# EAGLE schematic plc_sam4e (EAGLE 9.6.2)

## Sheet 1 of 2
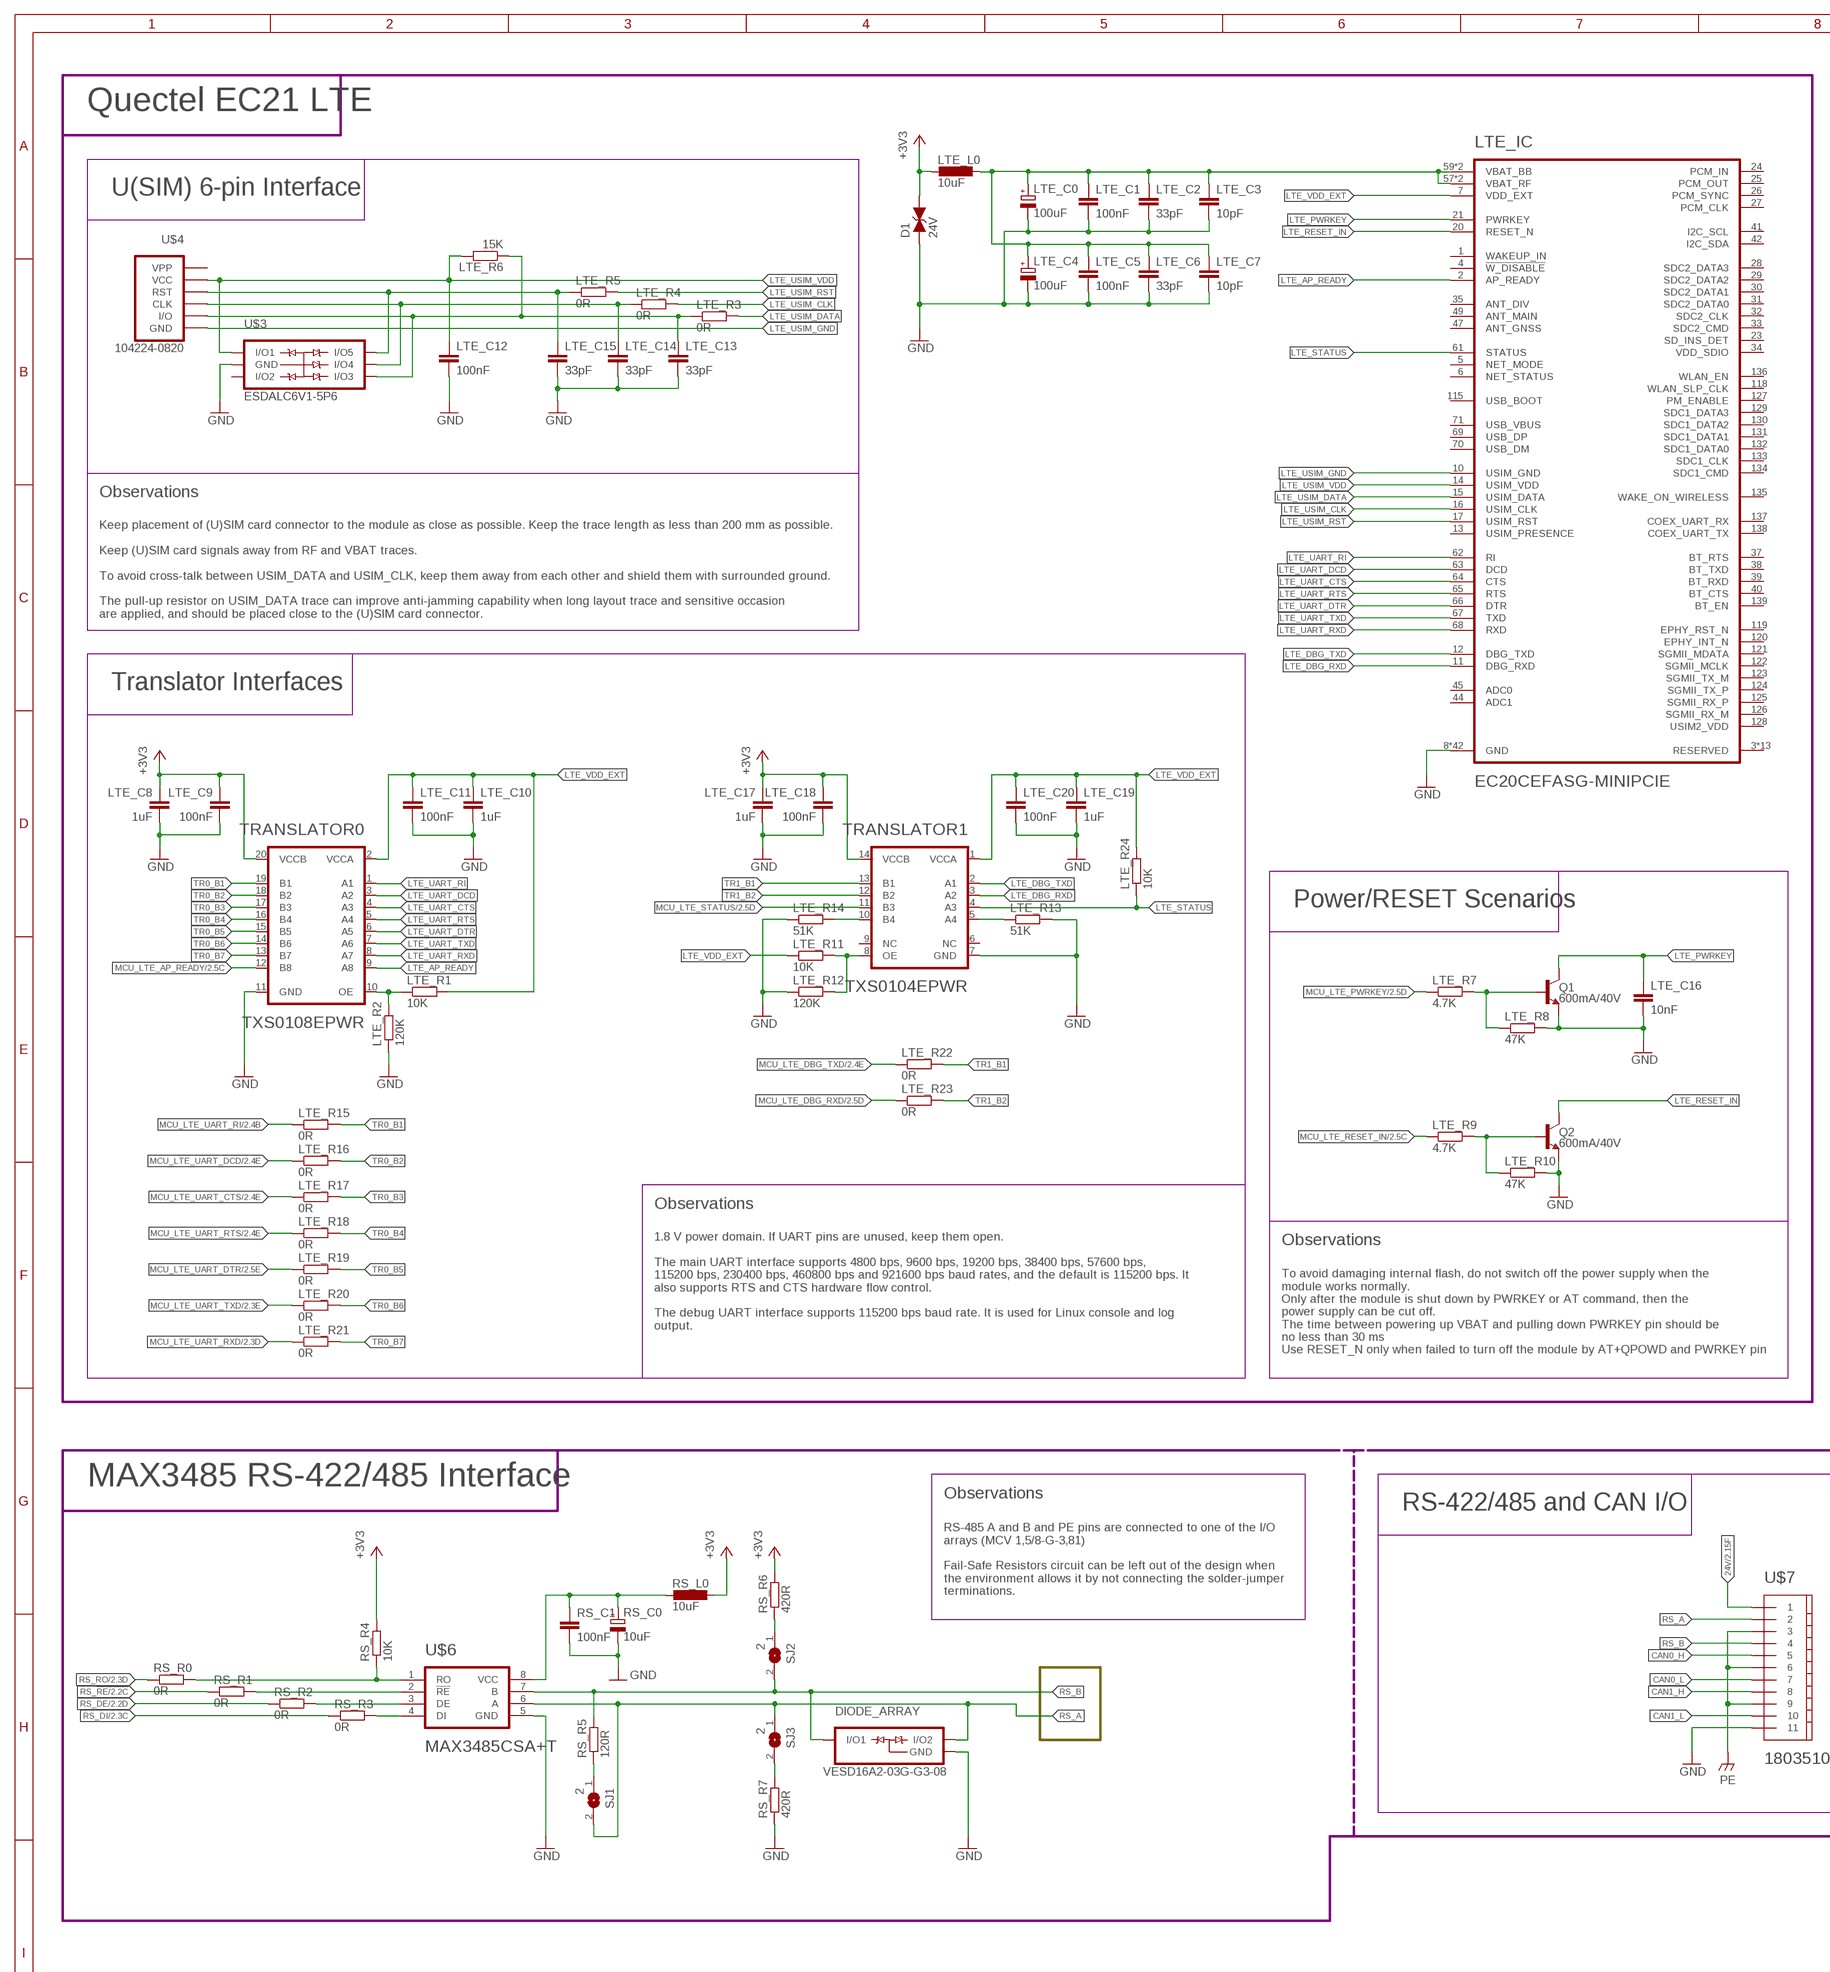
[diagram p0: schematic, sheet 1, part 1 of 2]
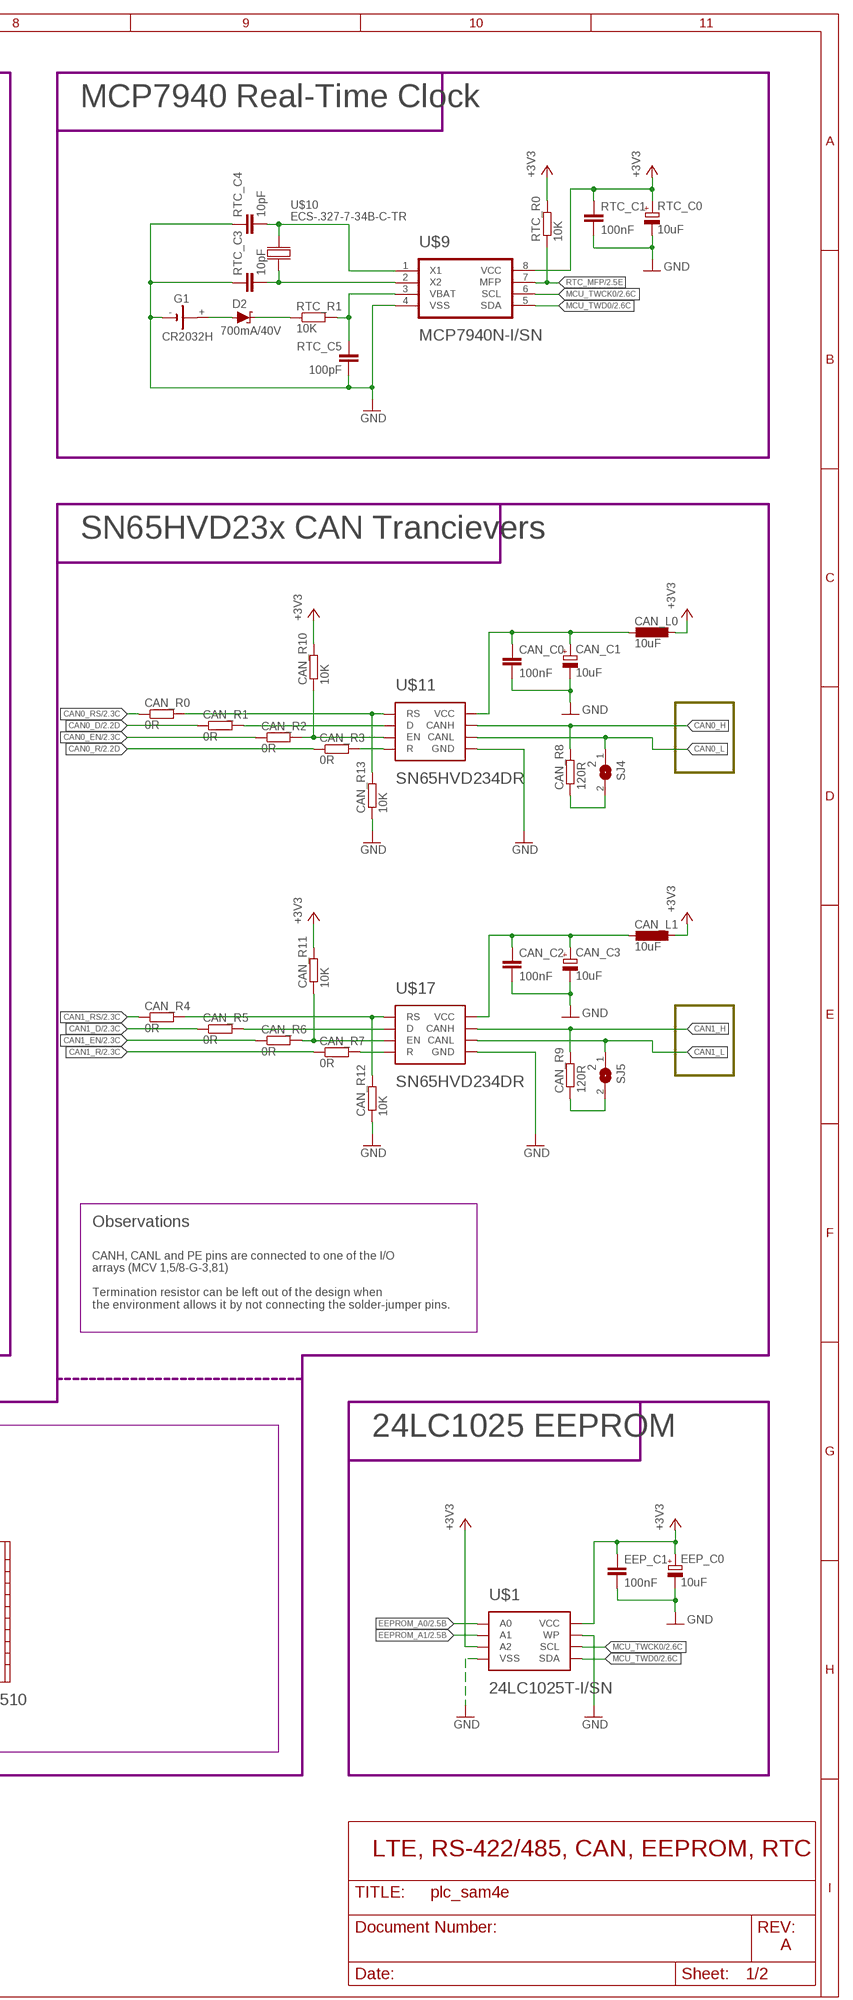
[diagram p1: schematic, sheet 1, part 2 of 2]

### Parts
CAN_C0  100nF  C-EUC0402  [C0402]
CAN_C1  10uF  CPOL-EUSMCB  [SMC_B]
CAN_C2  100nF  C-EUC0402  [C0402]
CAN_C3  10uF  CPOL-EUSMCB  [SMC_B]
CAN_L0  10uF  L-EUL1812  [L1812]
CAN_L1  10uF  L-EUL1812  [L1812]
CAN_R0  0R  R-EU_R0402  [R0402]
CAN_R1  0R  R-EU_R0402  [R0402]
CAN_R2  0R  R-EU_R0402  [R0402]
CAN_R3  0R  R-EU_R0402  [R0402]
CAN_R4  0R  R-EU_R0402  [R0402]
CAN_R5  0R  R-EU_R0402  [R0402]
CAN_R6  0R  R-EU_R0402  [R0402]
CAN_R7  0R  R-EU_R0402  [R0402]
CAN_R8  120R  R-EU_R0402  [R0402]
CAN_R9  120R  R-EU_R0402  [R0402]
CAN_R10  10K  R-EU_R0402  [R0402]
CAN_R11  10K  R-EU_R0402  [R0402]
CAN_R12  10K  R-EU_R0402  [R0402]
CAN_R13  10K  R-EU_R0402  [R0402]
D1  24V  DIODE_TVS  [0603]
D2  700mA/40V  DIODE-SCHOTTKY-ZLLS500  [SOT23-3]
DIODE_ARRAY  VESD16A2-03G-G3-08  [SOT-323-3]
EEP_C0  10uF  CPOL-EUSMCB  [SMC_B]
EEP_C1  100nF  C-EUC0402  [C0402]
G1  CR2032H  [CR2032H]
LTE_C0  100uF  CPOL-EUSMCB  [SMC_B]
LTE_C1  100nF  C-EUC0402  [C0402]
LTE_C2  33pF  C-EUC0402  [C0402]
LTE_C3  10pF  C-EUC0402  [C0402]
LTE_C4  100uF  CPOL-EUSMCB  [SMC_B]
LTE_C5  100nF  C-EUC0402  [C0402]
LTE_C6  33pF  C-EUC0402  [C0402]
LTE_C7  10pF  C-EUC0402  [C0402]
LTE_C8  1uF  C-EUC0402  [C0402]
LTE_C9  100nF  C-EUC0402  [C0402]
LTE_C10  1uF  C-EUC0402  [C0402]
LTE_C11  100nF  C-EUC0402  [C0402]
LTE_C12  100nF  C-EUC0402  [C0402]
LTE_C13  33pF  C-EUC0402  [C0402]
LTE_C14  33pF  C-EUC0402  [C0402]
LTE_C15  33pF  C-EUC0402  [C0402]
LTE_C16  10nF  C-EUC0402  [C0402]
LTE_C17  1uF  C-EUC0402  [C0402]
LTE_C18  100nF  C-EUC0402  [C0402]
LTE_C19  1uF  C-EUC0402  [C0402]
LTE_C20  100nF  C-EUC0402  [C0402]
LTE_IC  EC20CEFASG-MINIPCIE  [EC21]
LTE_L0  10uF  L-EUL1812  [L1812]
LTE_R1  10K  R-EU_R0402  [R0402]
LTE_R2  120K  R-EU_R0402  [R0402]
LTE_R3  0R  R-EU_R0402  [R0402]
LTE_R4  0R  R-EU_R0402  [R0402]
LTE_R5  0R  R-EU_R0402  [R0402]
LTE_R6  15K  R-EU_R0402  [R0402]
LTE_R7  4.7K  R-EU_R0402  [R0402]
LTE_R8  47K  R-EU_R0402  [R0402]
LTE_R9  4.7K  R-EU_R0402  [R0402]
LTE_R10  47K  R-EU_R0402  [R0402]
LTE_R11  10K  R-EU_R0402  [R0402]
LTE_R12  120K  R-EU_R0402  [R0402]
LTE_R13  51K  R-EU_R0402  [R0402]
LTE_R14  51K  R-EU_R0402  [R0402]
LTE_R15  0R  R-EU_R0402  [R0402]
LTE_R16  0R  R-EU_R0402  [R0402]
LTE_R17  0R  R-EU_R0402  [R0402]
LTE_R18  0R  R-EU_R0402  [R0402]
LTE_R19  0R  R-EU_R0402  [R0402]
LTE_R20  0R  R-EU_R0402  [R0402]
LTE_R21  0R  R-EU_R0402  [R0402]
LTE_R22  0R  R-EU_R0402  [R0402]
LTE_R23  0R  R-EU_R0402  [R0402]
LTE_R24  10K  R-EU_R0402  [R0402]
Q1  600mA/40V  TRANS_NPN-MMBT2222AL  [SOT23-3]
Q2  600mA/40V  TRANS_NPN-MMBT2222AL  [SOT23-3]
RS_C0  10uF  CPOL-EUSMCB  [SMC_B]
RS_C1  100nF  C-EUC0402  [C0402]
RS_L0  10uF  L-EUL1812  [L1812]
RS_R0  0R  R-EU_R0402  [R0402]
RS_R1  0R  R-EU_R0402  [R0402]
RS_R2  0R  R-EU_R0402  [R0402]
RS_R3  0R  R-EU_R0402  [R0402]
RS_R4  10K  R-EU_R0402  [R0402]
RS_R5  120R  R-EU_R0402  [R0402]
RS_R6  420R  R-EU_R0402  [R0402]
RS_R7  420R  R-EU_R0402  [R0402]
RTC_C0  10uF  CPOL-EUSMCB  [SMC_B]
RTC_C1  100nF  C-EUC0402  [C0402]
RTC_C3  10pF  C-EUC0402  [C0402]
RTC_C4  10pF  C-EUC0402  [C0402]
RTC_C5  100pF  C-EUC0402  [C0402]
RTC_R0  10K  R-EU_R0402  [R0402]
RTC_R1  10K  R-EU_R0402  [R0402]
SJ1  2  SJ  [SJ]
SJ2  2  SJ  [SJ]
SJ3  2  SJ  [SJ]
SJ4  2  SJ  [SJ]
SJ5  2  SJ  [SJ]
TRANSLATOR0  TXS0108EPWR  [TSSOP-20]
TRANSLATOR1  TXS0104EPWR  [TSSOP-14]
U$1  24LC1025T-I/SN  [SOIC-8]
U$3  ESDALC6V1-5P6  [SOT-666]
U$4  104224-0820  [104224-0820]
U$6  MAX3485CSA+T  [SOIC-8]
U$7  1803510  [1803510]
U$9  MCP7940N-I/SN  [SOIC-8]
U$10  ECS-.327-7-34B-C-TR  [3.2X1.5MM]
U$11  SN65HVD234DR  [SOIC-8]
U$17  SN65HVD234DR  [SOIC-8]

### Nets
24V: U$7.1 ; also sheet 2
+3V3: CAN_L0.1 CAN_L1.1 CAN_R10.2 CAN_R11.2 D1.2(C) EEP_C0.+ EEP_C1.1 LTE_C8.1 LTE_C9.1 LTE_C17.1 LTE_C18.1 LTE_L0.2 RS_L0.1 RS_R4.2 RS_R6.2 RTC_C0.+ RTC_C1.1 RTC_R0.2 TRANSLATOR0.20(VCCB) TRANSLATOR1.14(VCCB) U$1.3(A2) U$1.8(VCC) U$9.8(VCC) ; also sheet 2
CAN0_D: CAN_R1.1 ; also sheet 2
CAN0_EN: CAN_R2.1 ; also sheet 2
CAN0_H: CAN_R8.2 U$7.5 U$11.7(CANH)
CAN0_L: SJ4.1 U$7.7 U$11.6(CANL)
CAN0_R: CAN_R3.1 ; also sheet 2
CAN0_RS: CAN_R0.1 ; also sheet 2
CAN1_D: CAN_R5.1 ; also sheet 2
CAN1_EN: CAN_R6.1 ; also sheet 2
CAN1_H: CAN_R9.2 U$7.8 U$17.7(CANH)
CAN1_L: SJ5.1 U$7.10 U$17.6(CANL)
CAN1_R: CAN_R7.1 ; also sheet 2
CAN1_RS: CAN_R4.1 ; also sheet 2
EEPROM_A0: U$1.1(A0) ; also sheet 2
EEPROM_A1: U$1.2(A1) ; also sheet 2
GND: CAN_C0.2 CAN_C1.- CAN_C2.2 CAN_C3.- CAN_R12.1 CAN_R13.1 D1.1(A) DIODE_ARRAY.3(GND) EEP_C0.- EEP_C1.2 G1.- LTE_C0.- LTE_C1.2 LTE_C2.2 LTE_C3.2 LTE_C4.- LTE_C5.2 LTE_C6.2 LTE_C7.2 LTE_C8.2 LTE_C9.2 LTE_C10.2 LTE_C11.2 LTE_C12.2 LTE_C13.2 LTE_C14.2 LTE_C15.2 LTE_C16.2 LTE_C17.2 LTE_C18.2 LTE_C19.2 LTE_C20.2 LTE_IC.8(GND) LTE_IC.9(GND) LTE_IC.19(GND) LTE_IC.22(GND) LTE_IC.36(GND) LTE_IC.46(GND) LTE_IC.48(GND) LTE_IC.50(GND) LTE_IC.51(GND) LTE_IC.52(GND) LTE_IC.53(GND) LTE_IC.54(GND) LTE_IC.56(GND) LTE_IC.72(GND) LTE_IC.85(GND) LTE_IC.86(GND) LTE_IC.87(GND) LTE_IC.88(GND) LTE_IC.89(GND) LTE_IC.90(GND) LTE_IC.91(GND) LTE_IC.92(GND) LTE_IC.93(GND) LTE_IC.94(GND) LTE_IC.95(GND) LTE_IC.96(GND) LTE_IC.97(GND) LTE_IC.98(GND) LTE_IC.99(GND) LTE_IC.100(GND) LTE_IC.101(GND) LTE_IC.102(GND) LTE_IC.103(GND) LTE_IC.104(GND) LTE_IC.105(GND) LTE_IC.106(GND) LTE_IC.107(GND) LTE_IC.108(GND) LTE_IC.109(GND) LTE_IC.110(GND) LTE_IC.111(GND) LTE_IC.112(GND) LTE_R2.1 LTE_R8.2 LTE_R10.2 LTE_R12.1 LTE_R13.2 LTE_R14.1 Q1.2(E) Q2.2(E) RS_C0.- RS_C1.2 RS_R7.1 RTC_C0.- RTC_C1.2 RTC_C3.1 RTC_C4.1 RTC_C5.2 TRANSLATOR0.11(GND) TRANSLATOR1.7(GND) U$1.4(VSS) U$1.7(WP) U$3.2(GND) U$6.5(GND) U$7.11 U$9.4(VSS) U$11.2(GND) U$17.2(GND) ; also sheet 2
LTE_AP_READY: LTE_IC.2(AP_READY) TRANSLATOR0.9(A8)
LTE_DBG_RXD: LTE_IC.11(DBG_RXD) TRANSLATOR1.3(A2)
LTE_DBG_TXD: LTE_IC.12(DBG_TXD) TRANSLATOR1.2(A1)
LTE_PWRKEY: LTE_C16.1 LTE_IC.21(PWRKEY) Q1.3(C)
LTE_RESET_IN: LTE_IC.20(RESET_N) Q2.3(C)
LTE_STATUS: LTE_IC.61(STATUS) LTE_R24.1 TRANSLATOR1.4(A3)
LTE_UART_CTS: LTE_IC.64(CTS) TRANSLATOR0.4(A3)
LTE_UART_DCD: LTE_IC.63(DCD) TRANSLATOR0.3(A2)
LTE_UART_DTR: LTE_IC.66(DTR) TRANSLATOR0.6(A5)
LTE_UART_RI: LTE_IC.62(RI) TRANSLATOR0.1(A1)
LTE_UART_RTS: LTE_IC.65(RTS) TRANSLATOR0.5(A4)
LTE_UART_RXD: LTE_IC.68(RXD) TRANSLATOR0.8(A7)
LTE_UART_TXD: LTE_IC.67(TXD) TRANSLATOR0.7(A6)
LTE_USIM_CLK: LTE_IC.16(USIM_CLK) LTE_R4.2
LTE_USIM_DATA: LTE_IC.15(USIM_DATA) LTE_R3.2
LTE_USIM_GND: LTE_IC.10(USIM_GND) U$4.G1(GND) U$4.G2(GND) U$4.G3(GND) U$4.G4(GND) U$4.S4(GND)
LTE_USIM_RST: LTE_IC.17(USIM_RST) LTE_R5.2
LTE_USIM_VDD: LTE_C12.1 LTE_IC.14(USIM_VDD) LTE_R6.2 U$3.1(I/O1) U$4.S1(VCC)
LTE_VBAT: LTE_C0.+ LTE_C1.1 LTE_C2.1 LTE_C3.1 LTE_C4.+ LTE_C5.1 LTE_C6.1 LTE_C7.1 LTE_IC.57(VBAT_RF) LTE_IC.58(VBAT_RF) LTE_IC.59(VBAT_BB) LTE_IC.60(VBAT_BB) LTE_L0.1
LTE_VDD_EXT: LTE_C10.1 LTE_C11.1 LTE_C19.1 LTE_C20.1 LTE_IC.7(VDD_EXT) LTE_R1.2 LTE_R11.1 LTE_R24.2 TRANSLATOR0.2(VCCA) TRANSLATOR1.1(VCCA)
MCU_LTE_AP_READY: TRANSLATOR0.12(B8) ; also sheet 2
MCU_LTE_DBG_RXD: LTE_R23.1 ; also sheet 2
MCU_LTE_DBG_TXD: LTE_R22.1 ; also sheet 2
MCU_LTE_PWRKEY: LTE_R7.1 ; also sheet 2
MCU_LTE_RESET_IN: LTE_R9.1 ; also sheet 2
MCU_LTE_STATUS: TRANSLATOR1.11(B3) ; also sheet 2
MCU_LTE_UART_CTS: LTE_R17.1 ; also sheet 2
MCU_LTE_UART_DCD: LTE_R16.1 ; also sheet 2
MCU_LTE_UART_DTR: LTE_R19.1 ; also sheet 2
MCU_LTE_UART_RI: LTE_R15.1 ; also sheet 2
MCU_LTE_UART_RTS: LTE_R18.1 ; also sheet 2
MCU_LTE_UART_RXD: LTE_R21.1 ; also sheet 2
MCU_LTE_UART_TXD: LTE_R20.1 ; also sheet 2
MCU_TWCK0: U$1.6(SCL) U$9.6(SCL) ; also sheet 2
MCU_TWD0: U$1.5(SDA) U$9.5(SDA) ; also sheet 2
N$1: LTE_R7.2 LTE_R8.1 Q1.1(B)
N$2: RS_R0.2 RS_R4.1 U$6.1(RO)
N$3: RS_R1.2 U$6.2(!RE)
N$4: RS_R2.2 U$6.3(DE)
N$5: LTE_R9.2 LTE_R10.1 Q2.1(B)
N$6: LTE_R14.2 TRANSLATOR1.10(B4)
N$8: RTC_C4.2 U$9.1(X1) U$10.2
N$9: RS_R3.2 U$6.4(DI)
N$10: CAN_R3.2 U$11.4(R)
N$11: RTC_C3.2 U$9.2(X2) U$10.1
N$12: CAN_R2.2 CAN_R10.1 U$11.5(EN)
N$13: D2.3(C) RTC_R1.1
N$16: D2.1(A) G1.+
N$17: LTE_R13.1 TRANSLATOR1.5(A4)
N$18: RTC_C5.1 RTC_R1.2 U$9.3(VBAT)
N$19: CAN_R1.2 U$11.1(D)
N$21: RS_R5.1 SJ1.1
N$23: CAN_R0.2 CAN_R13.2 U$11.8(RS)
N$34: RS_R6.1 SJ2.1
N$35: RS_R7.2 SJ3.2
N$38: LTE_R1.1 LTE_R2.2 TRANSLATOR0.10(OE)
N$40: CAN_R4.2 CAN_R12.2 U$17.8(RS)
N$41: CAN_R5.2 U$17.1(D)
N$42: CAN_R6.2 CAN_R11.1 U$17.5(EN)
N$43: CAN_R7.2 U$17.4(R)
N$46: RS_C0.+ RS_C1.1 RS_L0.2 U$6.8(VCC)
N$49: CAN_R8.1 SJ4.2
N$50: CAN_R9.1 SJ5.2
N$51: LTE_C15.1 LTE_R5.1 U$3.6(I/O5) U$4.S2(RST)
N$52: LTE_C14.1 LTE_R4.1 U$3.5(I/O4) U$4.S3(CLK)
N$53: LTE_C13.1 LTE_R3.1 LTE_R6.1 U$3.4(I/O3) U$4.S6(I/O)
N$54: CAN_C0.1 CAN_C1.+ CAN_L0.2 U$11.3(VCC)
N$55: CAN_C2.1 CAN_C3.+ CAN_L1.2 U$17.3(VCC)
N$84: LTE_R11.2 LTE_R12.2 TRANSLATOR1.8(OE)
P$1: U$7.3 U$7.6 U$7.9 ; supply symbol labelled PE ; also sheet 2
RS_!RE: RS_R1.1 ; also sheet 2
RS_A: DIODE_ARRAY.2(I/O2) SJ1.2 SJ3.1 U$6.6(A) U$7.2
RS_B: DIODE_ARRAY.1(I/O1) RS_R5.2 SJ2.2 U$6.7(B) U$7.4
RS_DE: RS_R2.1 ; also sheet 2
RS_DI: RS_R3.1 ; also sheet 2
RS_RO: RS_R0.1 ; also sheet 2
RTC_MFP: RTC_R0.1 U$9.7(MFP) ; also sheet 2
TR0_B1: LTE_R15.2 TRANSLATOR0.19(B1)
TR0_B2: LTE_R16.2 TRANSLATOR0.18(B2)
TR0_B3: LTE_R17.2 TRANSLATOR0.17(B3)
TR0_B4: LTE_R18.2 TRANSLATOR0.16(B4)
TR0_B5: LTE_R19.2 TRANSLATOR0.15(B5)
TR0_B6: LTE_R20.2 TRANSLATOR0.14(B6)
TR0_B7: LTE_R21.2 TRANSLATOR0.13(B7)
TR1_B1: LTE_R22.2 TRANSLATOR1.13(B1)
TR1_B2: LTE_R23.2 TRANSLATOR1.12(B2)
Unconnected: G1.+@1(+) LTE_IC.1(WAKEUP_IN) LTE_IC.3(RESERVED) LTE_IC.4(!W_DISABLE) LTE_IC.5(NET_MODE) LTE_IC.6(NET_STATUS) LTE_IC.13(USIM_PRESENCE) LTE_IC.18(RESERVED) LTE_IC.23(SD_INS_DET) LTE_IC.24(PCM_IN) LTE_IC.25(PCM_OUT) LTE_IC.26(PCM_SYNC) LTE_IC.27(PCM_CLK) LTE_IC.28(SDC2_DATA3) LTE_IC.29(SDC2_DATA2) LTE_IC.30(SDC2_DATA1) LTE_IC.31(SDC2_DATA0) LTE_IC.32(SDC2_CLK) LTE_IC.33(SDC2_CMD) LTE_IC.34(VDD_SDIO) LTE_IC.35(ANT_DIV) LTE_IC.37(BT_RTS) LTE_IC.38(BT_TXD) LTE_IC.39(BT_RXD) LTE_IC.40(BT_CTS) LTE_IC.41(I2C_SCL) LTE_IC.42(I2C_SDA) LTE_IC.43(RESERVED) LTE_IC.44(ADC1) LTE_IC.45(ADC0) LTE_IC.47(ANT_GNSS) LTE_IC.49(ANT_MAIN) LTE_IC.55(RESERVED) LTE_IC.69(USB_DP) LTE_IC.70(USB_DM) LTE_IC.71(USB_VBUS) LTE_IC.113(RESERVED) LTE_IC.114(RESERVED) LTE_IC.115(USB_BOOT) LTE_IC.116(RESERVED) LTE_IC.117(RESERVED) LTE_IC.118(WLAN_SLP_CLK) LTE_IC.119(EPHY_RST_N) LTE_IC.120(EPHY_INT_N) LTE_IC.121(SGMII_MDATA) LTE_IC.122(SGMII_MCLK) LTE_IC.123(SGMII_TX_M) LTE_IC.124(SGMII_TX_P) LTE_IC.125(SGMII_RX_P) LTE_IC.126(SGMII_RX_M) LTE_IC.127(PM_ENABLE) LTE_IC.128(USIM2_VDD) LTE_IC.129(SDC1_DATA3) LTE_IC.130(SDC1_DATA2) LTE_IC.131(SDC1_DATA1) LTE_IC.132(SDC1_DATA0) LTE_IC.133(SDC1_CLK) LTE_IC.134(SDC1_CMD) LTE_IC.135(WAKE_ON_WIRELESS) LTE_IC.136(WLAN_EN) LTE_IC.137(COEX_UART_RX) LTE_IC.138(COEX_UART_TX) LTE_IC.139(BT_EN) LTE_IC.140(RESERVED) LTE_IC.141(RESERVED) LTE_IC.142(RESERVED) LTE_IC.143(RESERVED) LTE_IC.144(RESERVED) TRANSLATOR1.6(NC) TRANSLATOR1.9(NC) U$3.3(I/O2) U$4.S5(VPP)

### Notes on the sheet
- Quectel EC21 LTE | MCP7940 Real-Time Clock
- U(SIM) 6-pin Interface
- Observations
- SN65HVD23x CAN Trancievers
- Keep placement of (U)SIM card connector to the module as close as possible. Keep the trace length as less than 200 mm as possible.
  
  Keep (U)SIM card signals away from RF and VBAT traces.
  
  To avoid cross-talk between USIM_DATA and USIM_CLK, keep them away from each other and shield them with surrounded ground.
  
  The pull-up resistor on USIM_DATA trace can improve anti-jamming capability when long layout trace and sensitive occasion
  are applied, and should be placed close to the (U)SIM card connector.
- Translator Interfaces
- Power/RESET Scenarios
- Observations
- Observations
- Observations
- 1.8 V power domain. If UART pins are unused, keep them open.
  
  The main UART interface supports 4800 bps, 9600 bps, 19200 bps, 38400 bps, 57600 bps,
  115200 bps, 230400 bps, 460800 bps and 921600 bps baud rates, and the default is 115200 bps. It
  also supports RTS and CTS hardware flow control.
  
  The debug UART interface supports 115200 bps baud rate. It is used for Linux console and log
  output.
- To avoid damaging internal flash, do not switch off the power supply when the
  module works normally.
  Only after the module is shut down by PWRKEY or AT command, then the
  power supply can be cut off.
  The time between powering up VBAT and pulling down PWRKEY pin should be
  no less than 30 ms
  Use RESET_N only when failed to turn off the module by AT+QPOWD and PWRKEY pin
- CANH, CANL and PE pins are connected to one of the I/O
  arrays (MCV 1,5/8-G-3,81)
  
  Termination resistor can be left out of the design when
  the environment allows it by not connecting the solder-jumper pins.
- MAX3485 RS-422/485 Interface | 24LC1025 EEPROM
- Observations
- RS-422/485 and CAN I/O
- RS-485 A and B and PE pins are connected to one of the I/O
  arrays (MCV 1,5/8-G-3,81)
  
  Fail-Safe Resistors circuit can be left out of the design when
  the environment allows it by not connecting the solder-jumper
  terminations.
- LTE, RS-422/485, CAN, EEPROM, RTC
- A

## Sheet 2 of 2
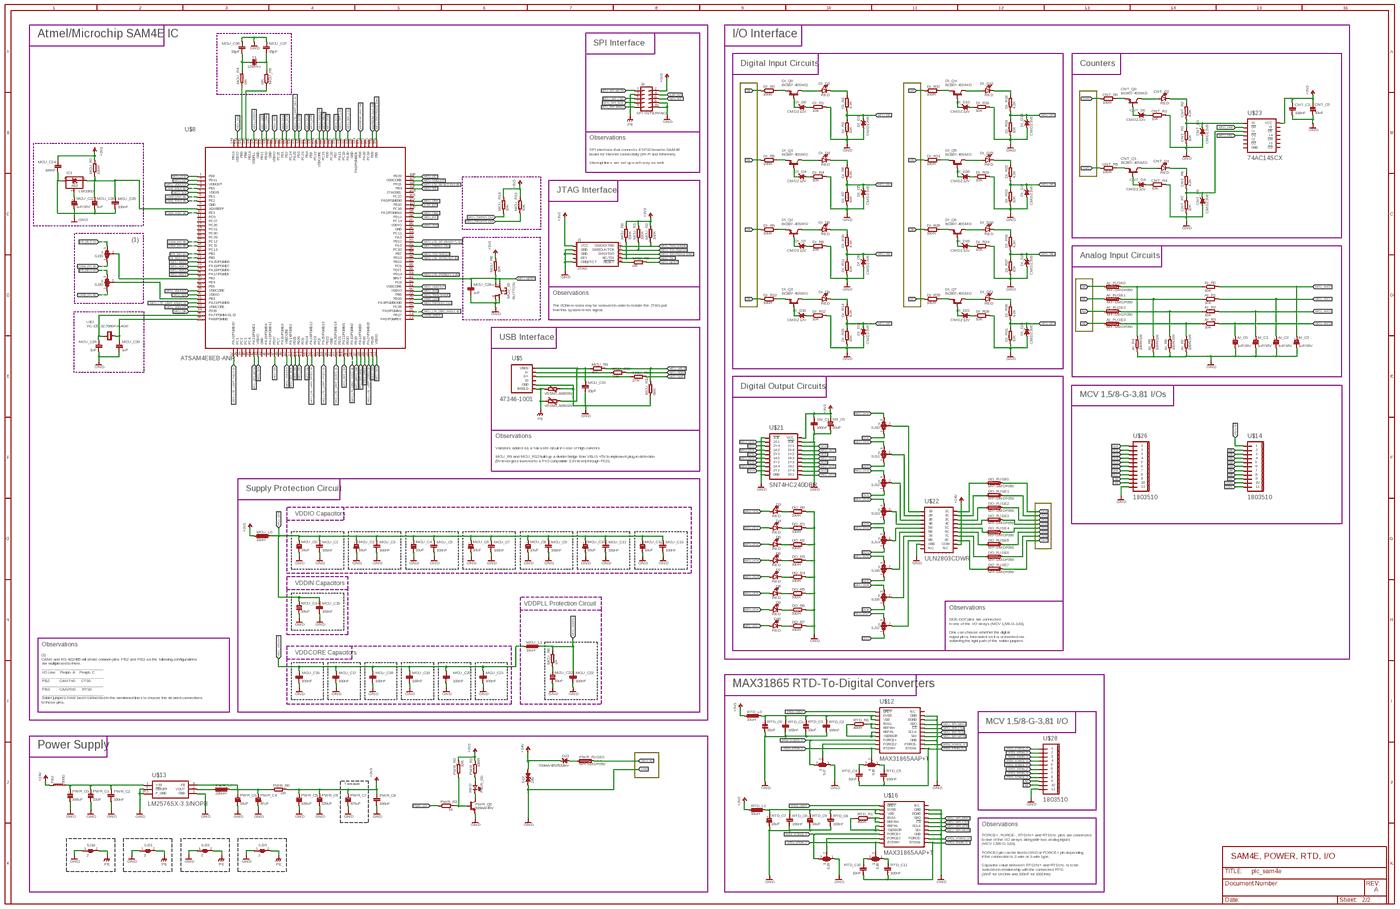
[diagram p2: schematic, sheet 2, overview]
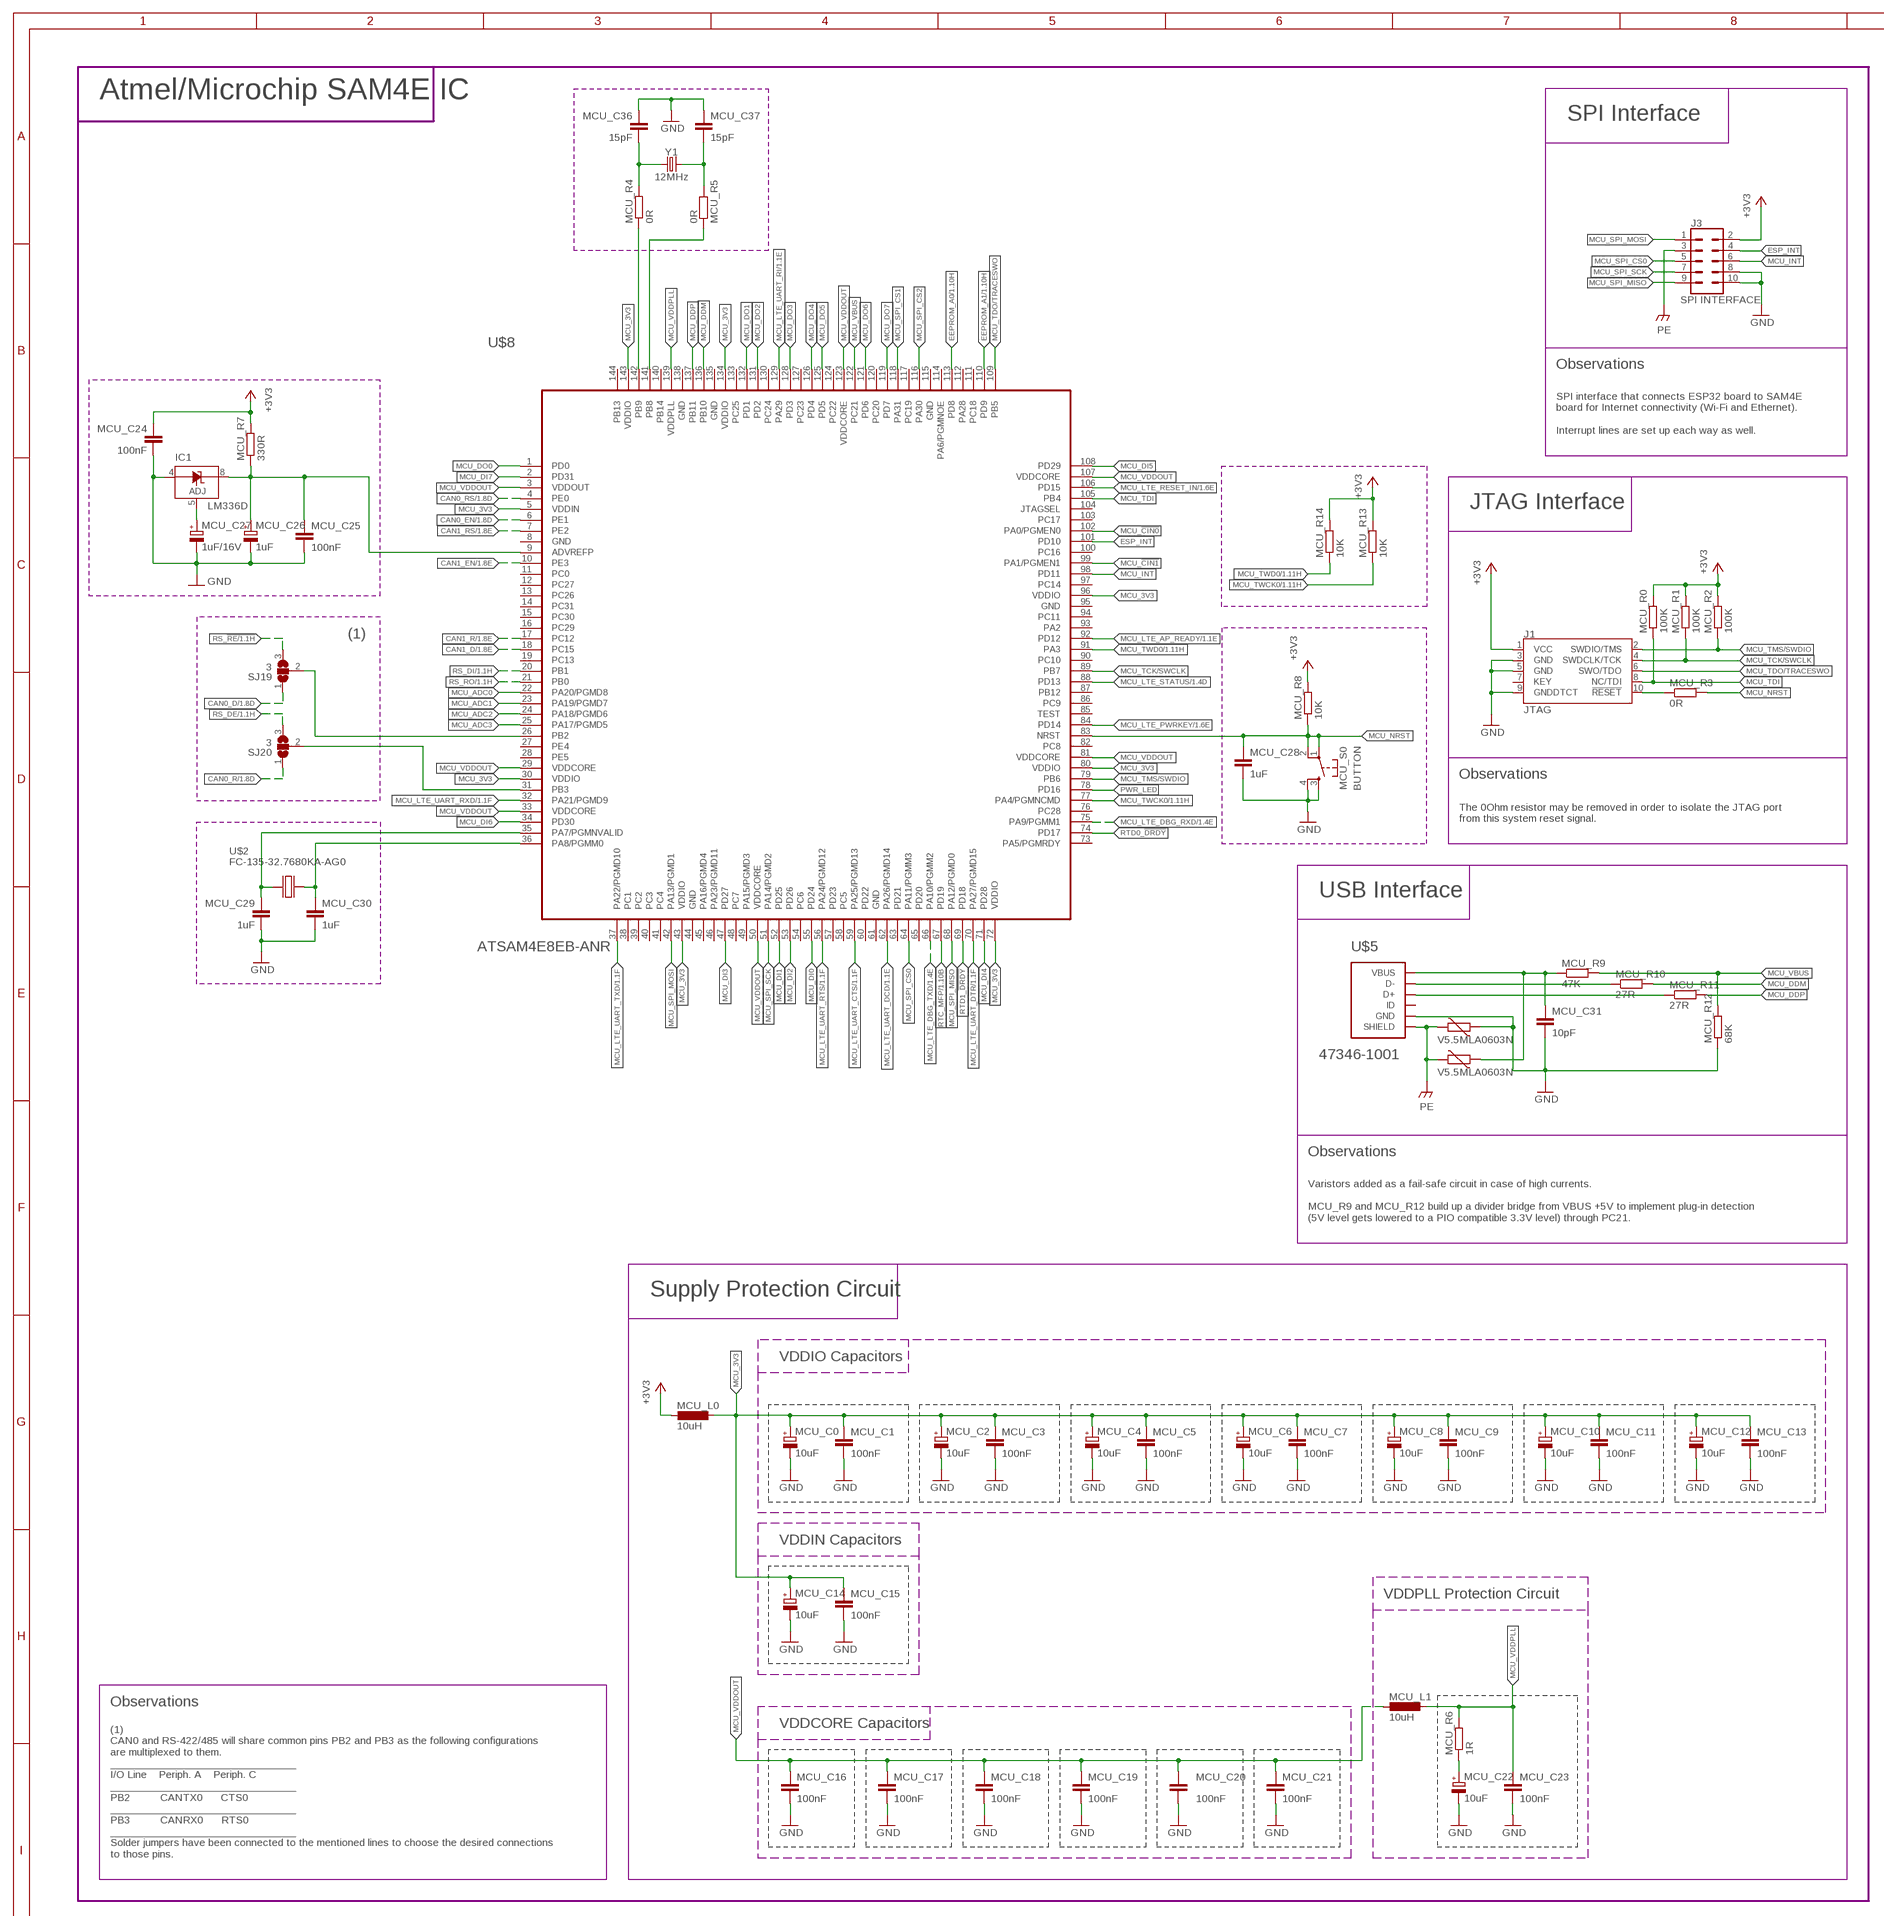
[diagram p3: schematic, sheet 2, part 1 of 4]
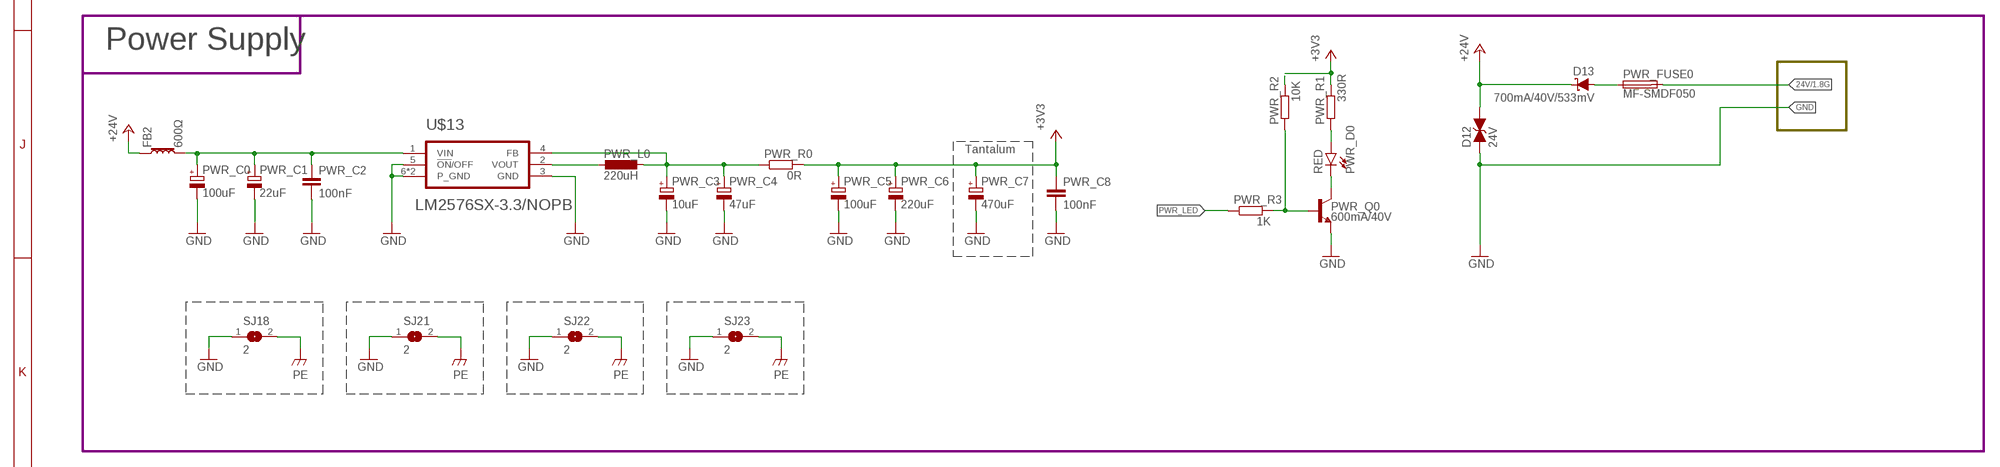
[diagram p4: schematic, sheet 2, part 2 of 4]
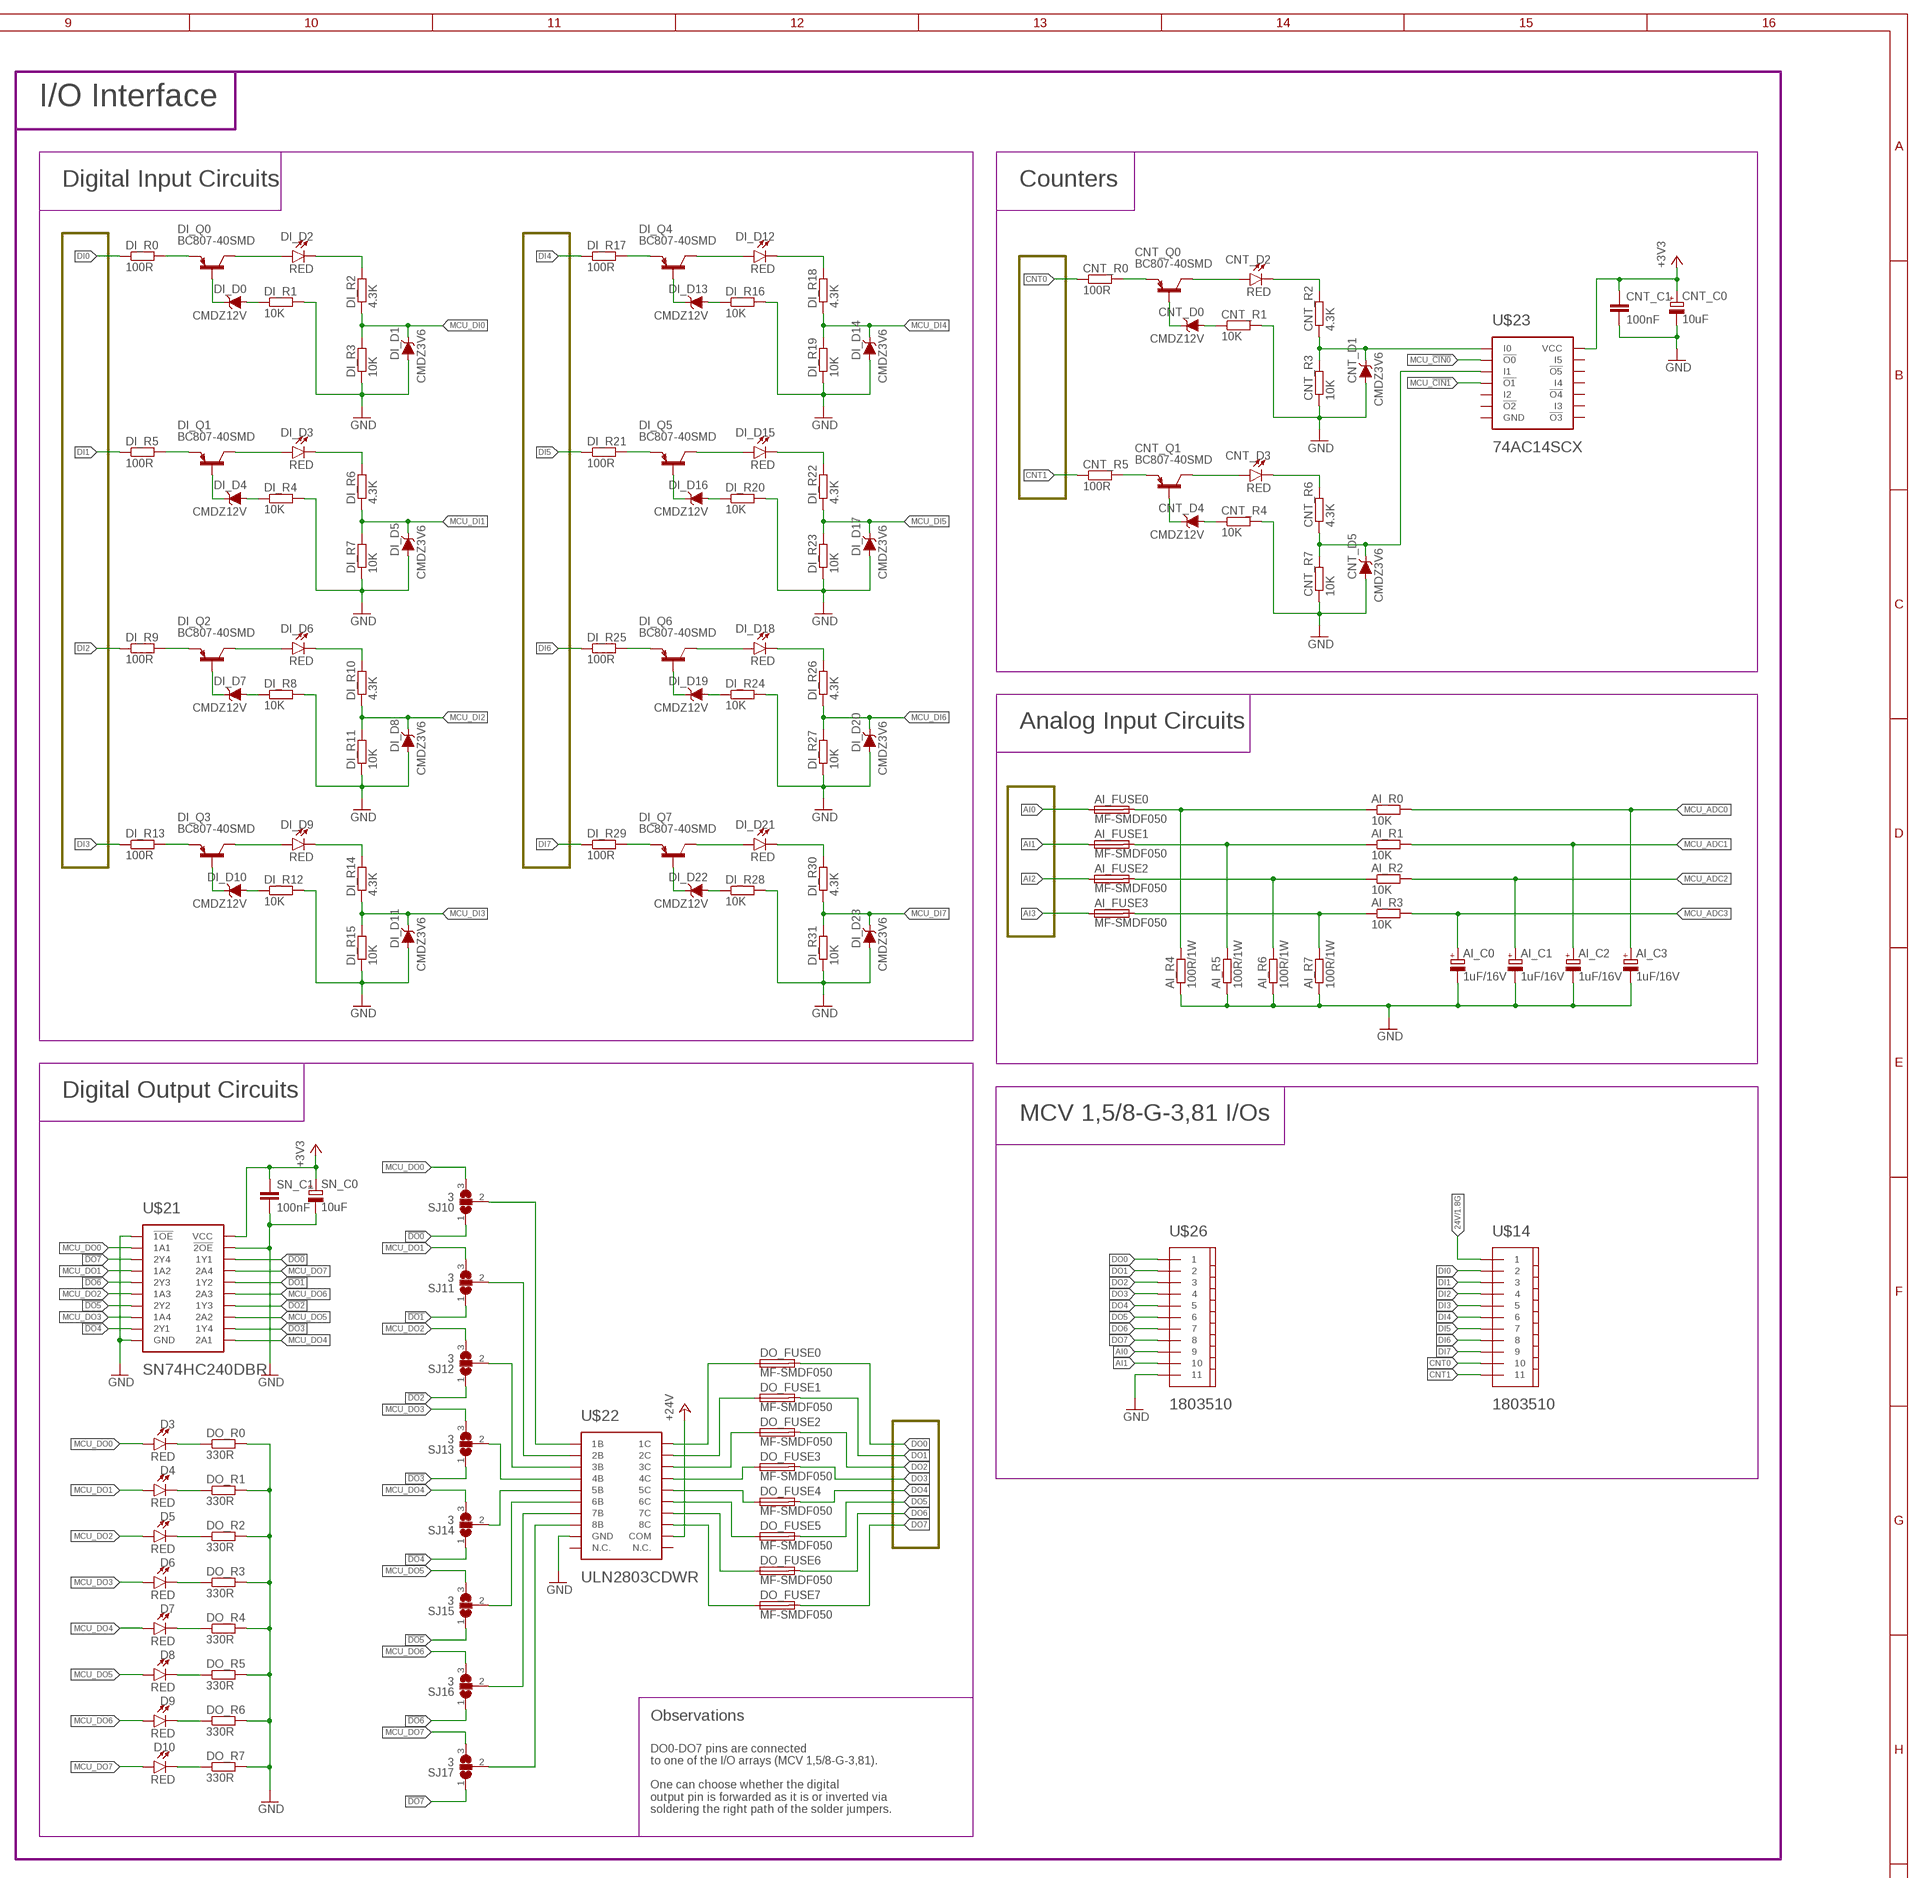
[diagram p5: schematic, sheet 2, part 3 of 4]
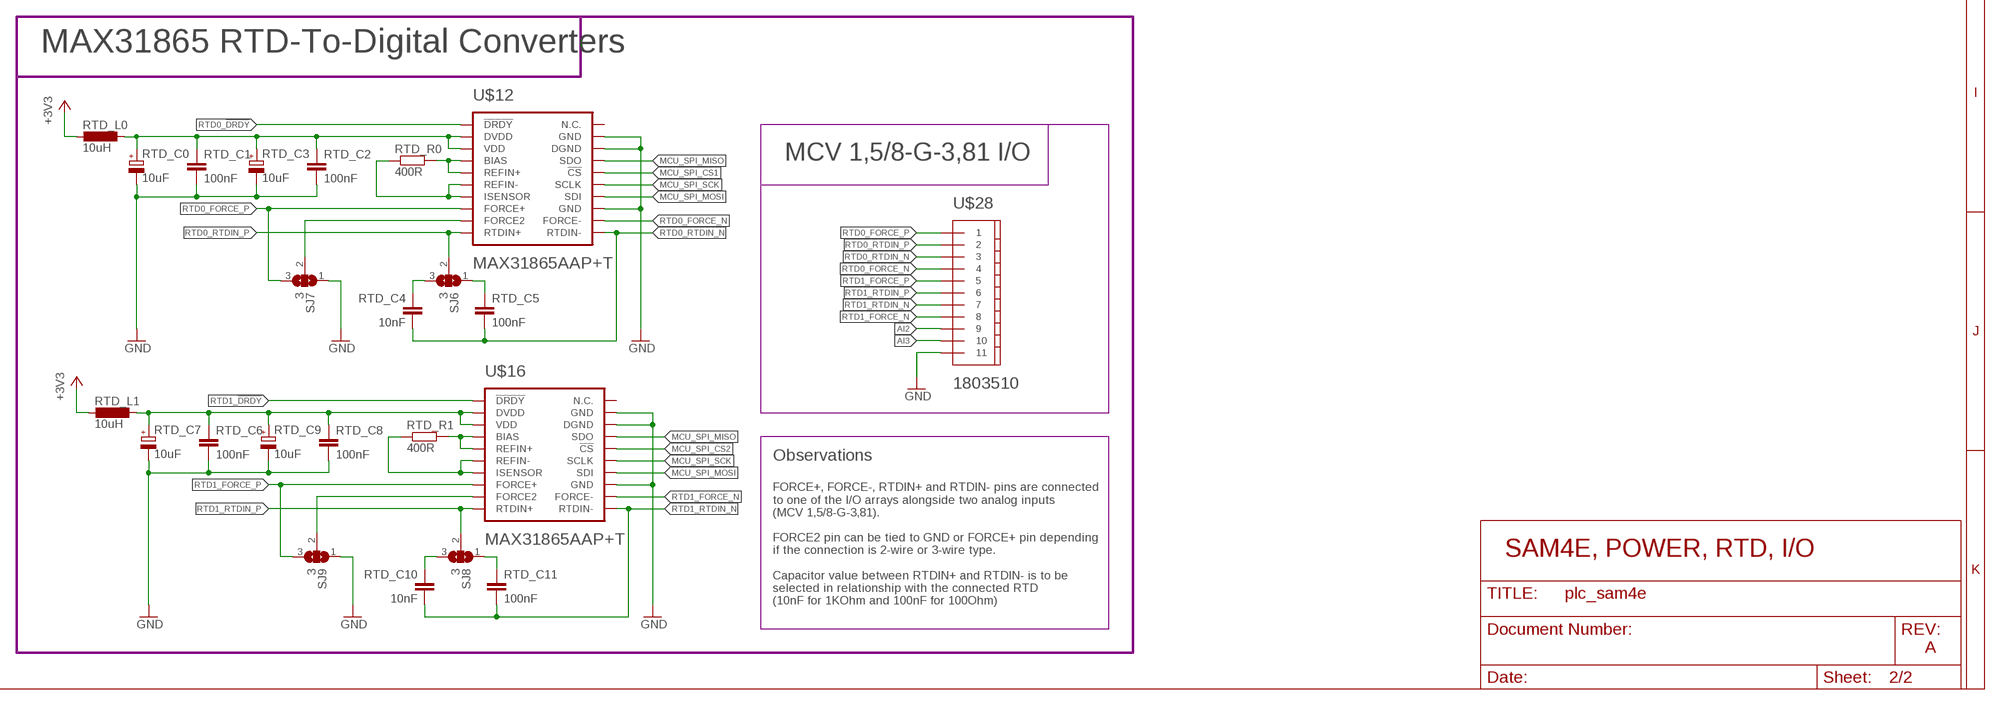
[diagram p6: schematic, sheet 2, part 4 of 4]

### Parts
AI_C0  1uF/16V  CPOL-EUSMCB  [SMC_B]
AI_C1  1uF/16V  CPOL-EUSMCB  [SMC_B]
AI_C2  1uF/16V  CPOL-EUSMCB  [SMC_B]
AI_C3  1uF/16V  CPOL-EUSMCB  [SMC_B]
AI_FUSE0  MF-SMDF050  [MF-SMDF050]
AI_FUSE1  MF-SMDF050  [MF-SMDF050]
AI_FUSE2  MF-SMDF050  [MF-SMDF050]
AI_FUSE3  MF-SMDF050  [MF-SMDF050]
AI_R0  10K  R-EU_R0402  [R0402]
AI_R1  10K  R-EU_R0402  [R0402]
AI_R2  10K  R-EU_R0402  [R0402]
AI_R3  10K  R-EU_R0402  [R0402]
AI_R4  100R/1W  R-EU_R0402  [R0402]
AI_R5  100R/1W  R-EU_R0402  [R0402]
AI_R6  100R/1W  R-EU_R0402  [R0402]
AI_R7  100R/1W  R-EU_R0402  [R0402]
CNT_C0  10uF  CPOL-EUSMCB  [SMC_B]
CNT_C1  100nF  C-EUC0402  [C0402]
CNT_D0  CMDZ12V  DIODE-ZENER-MMSZ5232BS  [SOD-323]
CNT_D1  CMDZ3V6  DIODE-ZENER-MMSZ5232BS  [SOD-323]
CNT_D2  RED  LED-RED1206  [LED-1206]
CNT_D3  RED  LED-RED1206  [LED-1206]
CNT_D4  CMDZ12V  DIODE-ZENER-MMSZ5232BS  [SOD-323]
CNT_D5  CMDZ3V6  DIODE-ZENER-MMSZ5232BS  [SOD-323]
CNT_Q0  BC807-40SMD  [SOT23-BEC]
CNT_Q1  BC807-40SMD  [SOT23-BEC]
CNT_R0  100R  R-EU_R0402  [R0402]
CNT_R1  10K  R-EU_R0402  [R0402]
CNT_R2  4.3K  R-EU_R0402  [R0402]
CNT_R3  10K  R-EU_R0402  [R0402]
CNT_R4  10K  R-EU_R0402  [R0402]
CNT_R5  100R  R-EU_R0402  [R0402]
CNT_R6  4.3K  R-EU_R0402  [R0402]
CNT_R7  10K  R-EU_R0402  [R0402]
D3  RED  LED-RED1206  [LED-1206]
D4  RED  LED-RED1206  [LED-1206]
D5  RED  LED-RED1206  [LED-1206]
D6  RED  LED-RED1206  [LED-1206]
D7  RED  LED-RED1206  [LED-1206]
D8  RED  LED-RED1206  [LED-1206]
D9  RED  LED-RED1206  [LED-1206]
D10  RED  LED-RED1206  [LED-1206]
D12  24V  DIODE_TVS  [0603]
D13  700mA/40V/533mV  DIODE-SCHOTTKY-ZLLS500  [SOT23-3]
DI_D0  CMDZ12V  DIODE-ZENER-MMSZ5232BS  [SOD-323]
DI_D1  CMDZ3V6  DIODE-ZENER-MMSZ5232BS  [SOD-323]
DI_D2  RED  LED-RED1206  [LED-1206]
DI_D3  RED  LED-RED1206  [LED-1206]
DI_D4  CMDZ12V  DIODE-ZENER-MMSZ5232BS  [SOD-323]
DI_D5  CMDZ3V6  DIODE-ZENER-MMSZ5232BS  [SOD-323]
DI_D6  RED  LED-RED1206  [LED-1206]
DI_D7  CMDZ12V  DIODE-ZENER-MMSZ5232BS  [SOD-323]
DI_D8  CMDZ3V6  DIODE-ZENER-MMSZ5232BS  [SOD-323]
DI_D9  RED  LED-RED1206  [LED-1206]
DI_D10  CMDZ12V  DIODE-ZENER-MMSZ5232BS  [SOD-323]
DI_D11  CMDZ3V6  DIODE-ZENER-MMSZ5232BS  [SOD-323]
DI_D12  RED  LED-RED1206  [LED-1206]
DI_D13  CMDZ12V  DIODE-ZENER-MMSZ5232BS  [SOD-323]
DI_D14  CMDZ3V6  DIODE-ZENER-MMSZ5232BS  [SOD-323]
DI_D15  RED  LED-RED1206  [LED-1206]
DI_D16  CMDZ12V  DIODE-ZENER-MMSZ5232BS  [SOD-323]
DI_D17  CMDZ3V6  DIODE-ZENER-MMSZ5232BS  [SOD-323]
DI_D18  RED  LED-RED1206  [LED-1206]
DI_D19  CMDZ12V  DIODE-ZENER-MMSZ5232BS  [SOD-323]
DI_D20  CMDZ3V6  DIODE-ZENER-MMSZ5232BS  [SOD-323]
DI_D21  RED  LED-RED1206  [LED-1206]
DI_D22  CMDZ12V  DIODE-ZENER-MMSZ5232BS  [SOD-323]
DI_D23  CMDZ3V6  DIODE-ZENER-MMSZ5232BS  [SOD-323]
DI_Q0  BC807-40SMD  [SOT23-BEC]
DI_Q1  BC807-40SMD  [SOT23-BEC]
DI_Q2  BC807-40SMD  [SOT23-BEC]
DI_Q3  BC807-40SMD  [SOT23-BEC]
DI_Q4  BC807-40SMD  [SOT23-BEC]
DI_Q5  BC807-40SMD  [SOT23-BEC]
DI_Q6  BC807-40SMD  [SOT23-BEC]
DI_Q7  BC807-40SMD  [SOT23-BEC]
DI_R0  100R  R-EU_R0402  [R0402]
DI_R1  10K  R-EU_R0402  [R0402]
DI_R2  4.3K  R-EU_R0402  [R0402]
DI_R3  10K  R-EU_R0402  [R0402]
DI_R4  10K  R-EU_R0402  [R0402]
DI_R5  100R  R-EU_R0402  [R0402]
DI_R6  4.3K  R-EU_R0402  [R0402]
DI_R7  10K  R-EU_R0402  [R0402]
DI_R8  10K  R-EU_R0402  [R0402]
DI_R9  100R  R-EU_R0402  [R0402]
DI_R10  4.3K  R-EU_R0402  [R0402]
DI_R11  10K  R-EU_R0402  [R0402]
DI_R12  10K  R-EU_R0402  [R0402]
DI_R13  100R  R-EU_R0402  [R0402]
DI_R14  4.3K  R-EU_R0402  [R0402]
DI_R15  10K  R-EU_R0402  [R0402]
DI_R16  10K  R-EU_R0402  [R0402]
DI_R17  100R  R-EU_R0402  [R0402]
DI_R18  4.3K  R-EU_R0402  [R0402]
DI_R19  10K  R-EU_R0402  [R0402]
DI_R20  10K  R-EU_R0402  [R0402]
DI_R21  100R  R-EU_R0402  [R0402]
DI_R22  4.3K  R-EU_R0402  [R0402]
DI_R23  10K  R-EU_R0402  [R0402]
DI_R24  10K  R-EU_R0402  [R0402]
DI_R25  100R  R-EU_R0402  [R0402]
DI_R26  4.3K  R-EU_R0402  [R0402]
DI_R27  10K  R-EU_R0402  [R0402]
DI_R28  10K  R-EU_R0402  [R0402]
DI_R29  100R  R-EU_R0402  [R0402]
DI_R30  4.3K  R-EU_R0402  [R0402]
DI_R31  10K  R-EU_R0402  [R0402]
DO_FUSE0  MF-SMDF050  [MF-SMDF050]
DO_FUSE1  MF-SMDF050  [MF-SMDF050]
DO_FUSE2  MF-SMDF050  [MF-SMDF050]
DO_FUSE3  MF-SMDF050  [MF-SMDF050]
DO_FUSE4  MF-SMDF050  [MF-SMDF050]
DO_FUSE5  MF-SMDF050  [MF-SMDF050]
DO_FUSE6  MF-SMDF050  [MF-SMDF050]
DO_FUSE7  MF-SMDF050  [MF-SMDF050]
DO_R0  330R  R-EU_R0402  [R0402]
DO_R1  330R  R-EU_R0402  [R0402]
DO_R2  330R  R-EU_R0402  [R0402]
DO_R3  330R  R-EU_R0402  [R0402]
DO_R4  330R  R-EU_R0402  [R0402]
DO_R5  330R  R-EU_R0402  [R0402]
DO_R6  330R  R-EU_R0402  [R0402]
DO_R7  330R  R-EU_R0402  [R0402]
FB2  600Ω  FERRITE_BEAD-0805-600Ω-100MHZ  [0805]
IC1  LM336D  [SO08]
J1  JTAG  CORTEX_JTAG_DEBUG_SMD-UNSHROUDED  [2X5-SMD-UNSHROUDED]
J3  SPI INTERFACE  CONN_05X2SHD_SMD  [2X5-SHROUDED_SMD]
MCU_C0  10uF  CPOL-EUSMCB  [SMC_B]
MCU_C1  100nF  C-EUC0402  [C0402]
MCU_C2  10uF  CPOL-EUSMCB  [SMC_B]
MCU_C3  100nF  C-EUC0402  [C0402]
MCU_C4  10uF  CPOL-EUSMCB  [SMC_B]
MCU_C5  100nF  C-EUC0402  [C0402]
MCU_C6  10uF  CPOL-EUSMCB  [SMC_B]
MCU_C7  100nF  C-EUC0402  [C0402]
MCU_C8  10uF  CPOL-EUSMCB  [SMC_B]
MCU_C9  100nF  C-EUC0402  [C0402]
MCU_C10  10uF  CPOL-EUSMCB  [SMC_B]
MCU_C11  100nF  C-EUC0402  [C0402]
MCU_C12  10uF  CPOL-EUSMCB  [SMC_B]
MCU_C13  100nF  C-EUC0402  [C0402]
MCU_C14  10uF  CPOL-EUSMCB  [SMC_B]
MCU_C15  100nF  C-EUC0402  [C0402]
MCU_C16  100nF  C-EUC0402  [C0402]
MCU_C17  100nF  C-EUC0402  [C0402]
MCU_C18  100nF  C-EUC0402  [C0402]
MCU_C19  100nF  C-EUC0402  [C0402]
MCU_C20  100nF  C-EUC0402  [C0402]
MCU_C21  100nF  C-EUC0402  [C0402]
MCU_C22  10uF  CPOL-EUSMCB  [SMC_B]
MCU_C23  100nF  C-EUC0402  [C0402]
MCU_C24  100nF  C-EUC0402  [C0402]
MCU_C25  100nF  C-EUC0402  [C0402]
MCU_C26  1uF  CPOL-EUSMCB  [SMC_B]
MCU_C27  1uF/16V  CPOL-EUSMCB  [SMC_B]
MCU_C28  1uF  C-EUC0402  [C0402]
MCU_C29  1uF  C-EUC0402  [C0402]
MCU_C30  1uF  C-EUC0402  [C0402]
MCU_C31  10pF  C-EUC0402  [C0402]
MCU_C36  15pF  C-EUC0402  [C0402]
MCU_C37  15pF  C-EUC0402  [C0402]
MCU_L0  10uH  L-EUL1812  [L1812]
MCU_L1  10uH  L-EUL1812  [L1812]
MCU_R0  100K  R-EU_R0402  [R0402]
MCU_R1  100K  R-EU_R0402  [R0402]
MCU_R2  100K  R-EU_R0402  [R0402]
MCU_R3  0R  R-EU_R0402  [R0402]
MCU_R4  0R  R-EU_R0402  [R0402]
MCU_R5  0R  R-EU_R0402  [R0402]
MCU_R6  1R  R-EU_R0402  [R0402]
MCU_R7  330R  R-EU_R0402  [R0402]
MCU_R8  10K  R-EU_R0402  [R0402]
MCU_R9  47K  R-EU_R0402  [R0402]
MCU_R10  27R  R-EU_R0402  [R0402]
MCU_R11  27R  R-EU_R0402  [R0402]
MCU_R12  68K  R-EU_R0402  [R0402]
MCU_R13  10K  R-EU_R0402  [R0402]
MCU_R14  10K  R-EU_R0402  [R0402]
MCU_S0  BUTTON  MOMENTARY-SWITCH-SPST-2-SMD-4.6X2.8MM  [TACTILE_SWITCH_SMD_4.6X2.8MM]
MCU_VAR0  V5.5MLA0603N  VARISTORCN0603  [CT/CN0603]
MCU_VAR1  V5.5MLA0603N  VARISTORCN0603  [CT/CN0603]
PWR_C0  100uF  CPOL-EUSMCB  [SMC_B]
PWR_C1  22uF  CPOL-EUSMCB  [SMC_B]
PWR_C2  100nF  C-EUC0402  [C0402]
PWR_C3  10uF  CPOL-EUSMCB  [SMC_B]
PWR_C4  47uF  CPOL-EUSMCB  [SMC_B]
PWR_C5  100uF  CPOL-EUSMCB  [SMC_B]
PWR_C6  220uF  CPOL-EUSMCB  [SMC_B]
PWR_C7  470uF  CPOL-EUSMCB  [SMC_B]
PWR_C8  100nF  C-EUC0402  [C0402]
PWR_D0  RED  LED-RED1206  [LED-1206]
PWR_FUSE0  MF-SMDF050  [MF-SMDF050]
PWR_L0  220uH  L-EUL1812  [L1812]
PWR_Q0  600mA/40V  TRANS_NPN-MMBT2222AL  [SOT23-3]
PWR_R0  0R  R-EU_R0402  [R0402]
PWR_R1  330R  R-EU_R0402  [R0402]
PWR_R2  10K  R-EU_R0402  [R0402]
PWR_R3  1K  R-EU_R0402  [R0402]
RTD_C0  10uF  CPOL-EUSMCB  [SMC_B]
RTD_C1  100nF  C-EUC0402  [C0402]
RTD_C2  100nF  C-EUC0402  [C0402]
RTD_C3  10uF  CPOL-EUSMCB  [SMC_B]
RTD_C4  10nF  C-EUC0402  [C0402]
RTD_C5  100nF  C-EUC0402  [C0402]
RTD_C6  100nF  C-EUC0402  [C0402]
RTD_C7  10uF  CPOL-EUSMCB  [SMC_B]
RTD_C8  100nF  C-EUC0402  [C0402]
RTD_C9  10uF  CPOL-EUSMCB  [SMC_B]
RTD_C10  10nF  C-EUC0402  [C0402]
RTD_C11  100nF  C-EUC0402  [C0402]
RTD_L0  10uH  L-EUL1812  [L1812]
RTD_L1  10uH  L-EUL1812  [L1812]
RTD_R0  400R  R-EU_R0402  [R0402]
RTD_R1  400R  R-EU_R0402  [R0402]
SJ6  3  SJ2W  [SJ_2]
SJ7  3  SJ2W  [SJ_2]
SJ8  3  SJ2W  [SJ_2]
SJ9  3  SJ2W  [SJ_2]
SJ10  3  SJ2W  [SJ_2]
SJ11  3  SJ2W  [SJ_2]
SJ12  3  SJ2W  [SJ_2]
SJ13  3  SJ2W  [SJ_2]
SJ14  3  SJ2W  [SJ_2]
SJ15  3  SJ2W  [SJ_2]
SJ16  3  SJ2W  [SJ_2]
SJ17  3  SJ2W  [SJ_2]
SJ18  2  SJ  [SJ]
SJ19  3  SJ2W  [SJ_2]
SJ20  3  SJ2W  [SJ_2]
SJ21  2  SJ  [SJ]
SJ22  2  SJ  [SJ]
SJ23  2  SJ  [SJ]
SN_C0  10uF  CPOL-EUSMCB  [SMC_B]
SN_C1  100nF  C-EUC0402  [C0402]
U$2  FC-135-32.7680KA-AG0  [3.2X1.5MM]
U$5  47346-1001  [47346-1001]
U$8  ATSAM4E8EB-ANR  [LQFP-144]
U$12  MAX31865AAP+T  [TSSOP-20]
U$13  LM2576SX-3.3/NOPB  [TO-263-5]
U$14  1803510  [1803510]
U$16  MAX31865AAP+T  [TSSOP-20]
U$21  SN74HC240DBR  [SSOP-20]
U$22  ULN2803CDWR  [SOIC-20]
U$23  74AC14SCX  [SOIC-14]
U$26  1803510  [1803510]
U$28  1803510  [1803510]
Y1  12MHz  CRYSTALSMD-3.2X2.5  [CRYSTAL-SMD-3.2X2.5MM]

### Nets
24V: PWR_FUSE0.2 U$14.1 ; also sheet 1
!DO0: SJ10.1 U$21.18(1Y1)
!DO1: SJ11.1 U$21.16(1Y2)
!DO2: SJ12.1 U$21.14(1Y3)
!DO3: SJ13.1 U$21.12(1Y4)
!DO4: SJ14.1 U$21.9(2Y1)
!DO5: SJ15.1 U$21.7(2Y2)
!DO6: SJ16.1 U$21.5(2Y3)
!DO7: SJ17.1 U$21.3(2Y4)
+3V3: CNT_C0.+ CNT_C1.1 J1.1(VCC) J3.2 MCU_C24.1 MCU_L0.2 MCU_R0.2 MCU_R1.2 MCU_R2.2 MCU_R7.2 MCU_R8.2 MCU_R13.2 MCU_R14.2 PWR_C5.+ PWR_C6.+ PWR_C7.+ PWR_C8.1 PWR_R0.2 PWR_R1.2 PWR_R2.2 RTD_L0.2 RTD_L1.2 SN_C0.+ SN_C1.1 U$21.20(VCC) U$23.14(VCC) ; also sheet 1
+24V: D12.2(C) D13.3(C) FB2.1 U$22.12(COM)
AI0: AI_FUSE0.1 U$26.9
AI1: AI_FUSE1.1 U$26.10
AI2: AI_FUSE2.1 U$28.9
AI3: AI_FUSE3.1 U$28.10
CAN0_D: SJ19.1 ; also sheet 1
CAN0_EN: U$8.6(PE1) ; also sheet 1
CAN0_R: SJ20.1 ; also sheet 1
CAN0_RS: U$8.4(PE0) ; also sheet 1
CAN1_D: U$8.18(PC15) ; also sheet 1
CAN1_EN: U$8.10(PE3) ; also sheet 1
CAN1_R: U$8.17(PC12) ; also sheet 1
CAN1_RS: U$8.7(PE2) ; also sheet 1
CNT0: CNT_R0.1 U$14.10
CNT1: CNT_R5.1 U$14.11
DI0: DI_R0.1 U$14.2
DI1: DI_R5.1 U$14.3
DI2: DI_R9.1 U$14.4
DI3: DI_R13.1 U$14.5
DI4: DI_R17.1 U$14.6
DI5: DI_R21.1 U$14.7
DI6: DI_R25.1 U$14.8
DI7: DI_R29.1 U$14.9
DO0: DO_FUSE0.2 U$26.1
DO1: DO_FUSE1.2 U$26.2
DO2: DO_FUSE2.2 U$26.3
DO3: DO_FUSE3.2 U$26.4
DO4: DO_FUSE4.2 U$26.5
DO5: DO_FUSE5.2 U$26.6
DO6: DO_FUSE6.2 U$26.7
DO7: DO_FUSE7.2 U$26.8
EEPROM_A0: U$8.113(PD8) ; also sheet 1
EEPROM_A1: U$8.110(PD9) ; also sheet 1
ESP_INT: J3.4 U$8.101(PD10)
GND: AI_C0.- AI_C1.- AI_C2.- AI_C3.- AI_R4.1 AI_R5.1 AI_R6.1 AI_R7.1 CNT_C0.- CNT_C1.2 CNT_D1.A CNT_D5.A CNT_R1.2 CNT_R3.1 CNT_R4.2 CNT_R7.1 D12.1(A) DI_D1.A DI_D5.A DI_D8.A DI_D11.A DI_D14.A DI_D17.A DI_D20.A DI_D23.A DI_R1.2 DI_R3.1 DI_R4.2 DI_R7.1 DI_R8.2 DI_R11.1 DI_R12.2 DI_R15.1 DI_R16.2 DI_R19.1 DI_R20.2 DI_R23.1 DI_R24.2 DI_R27.1 DI_R28.2 DI_R31.1 DO_R0.2 DO_R1.2 DO_R2.2 DO_R3.2 DO_R4.2 DO_R5.2 DO_R6.2 DO_R7.2 IC1.4(A) J1.3(GND) J1.5(GND) J1.9(GNDDTCT) J3.8 J3.10 MCU_C0.- MCU_C1.2 MCU_C2.- MCU_C3.2 MCU_C4.- MCU_C5.2 MCU_C6.- MCU_C7.2 MCU_C8.- MCU_C9.2 MCU_C10.- MCU_C11.2 MCU_C12.- MCU_C13.2 MCU_C14.- MCU_C15.2 MCU_C16.2 MCU_C17.2 MCU_C18.2 MCU_C19.2 MCU_C20.2 MCU_C21.2 MCU_C22.- MCU_C23.2 MCU_C24.2 MCU_C25.2 MCU_C26.- MCU_C27.- MCU_C28.2 MCU_C29.2 MCU_C30.2 MCU_C31.2 MCU_C36.1 MCU_C37.1 MCU_R12.1 MCU_S0.3 MCU_S0.4 MCU_VAR0.1 PWR_C0.- PWR_C1.- PWR_C2.2 PWR_C3.- PWR_C4.- PWR_C5.- PWR_C6.- PWR_C7.- PWR_C8.2 PWR_Q0.2(E) RTD_C0.- RTD_C1.2 RTD_C2.2 RTD_C3.- RTD_C6.2 RTD_C7.- RTD_C8.2 RTD_C9.- SJ7.1 SJ9.1 SJ18.1 SJ21.1 SJ22.1 SJ23.1 SN_C0.- SN_C1.2 U$5.5(GND) U$12.13(GND) U$12.18(DGND) U$12.19(GND) U$13.3(GND) U$13.5(!ON!/OFF) U$13.6(P_GND) U$13.7(P_GND) U$16.13(GND) U$16.18(DGND) U$16.19(GND) U$21.1(!1OE) U$21.10(GND) U$21.19(!2OE) U$22.9(GND) U$26.11 U$28.11 ; also sheet 1
MCU_3V3: MCU_C0.+ MCU_C1.1 MCU_C2.+ MCU_C3.1 MCU_C4.+ MCU_C5.1 MCU_C6.+ MCU_C7.1 MCU_C8.+ MCU_C9.1 MCU_C10.+ MCU_C11.1 MCU_C12.+ MCU_C13.1 MCU_C14.+ MCU_C15.1 MCU_L0.1 U$8.5(VDDIN) U$8.30(VDDIO) U$8.43(VDDIO) U$8.72(VDDIO) U$8.80(VDDIO) U$8.96(VDDIO) U$8.134(VDDIO) U$8.143(VDDIO)
MCU_!CIN0: U$8.102(PA0/PGMEN0) U$23.2(!O0)
MCU_!CIN1: U$8.99(PA1/PGMEN1) U$23.4(!O1)
MCU_ADC0: AI_C3.+ AI_R0.2 U$8.22(PA20/PGMD8)
MCU_ADC1: AI_C2.+ AI_R1.2 U$8.23(PA19/PGMD7)
MCU_ADC2: AI_C1.+ AI_R2.2 U$8.24(PA18/PGMD6)
MCU_ADC3: AI_C0.+ AI_R3.2 U$8.25(PA17/PGMD5)
MCU_ADVREFP: IC1.8(C) MCU_C25.1 MCU_C26.+ MCU_R7.1 U$8.9(ADVREFP)
MCU_DDM: MCU_R10.2 U$8.136(PB10)
MCU_DDP: MCU_R11.2 U$8.137(PB11)
MCU_DI0: DI_D1.C DI_R2.1 DI_R3.2 U$8.55(PD24)
MCU_DI1: DI_D5.C DI_R6.1 DI_R7.2 U$8.52(PD25)
MCU_DI2: DI_D8.C DI_R10.1 DI_R11.2 U$8.53(PD26)
MCU_DI3: DI_D11.C DI_R14.1 DI_R15.2 U$8.47(PD27)
MCU_DI4: DI_D14.C DI_R18.1 DI_R19.2 U$8.71(PD28)
MCU_DI5: DI_D17.C DI_R22.1 DI_R23.2 U$8.108(PD29)
MCU_DI6: DI_D20.C DI_R26.1 DI_R27.2 U$8.34(PD30)
MCU_DI7: DI_D23.C DI_R30.1 DI_R31.2 U$8.2(PD31)
MCU_DO0: D3.A SJ10.3 U$8.1(PD0) U$21.2(1A1)
MCU_DO1: D4.A SJ11.3 U$8.132(PD1) U$21.4(1A2)
MCU_DO2: D5.A SJ12.3 U$8.131(PD2) U$21.6(1A3)
MCU_DO3: D6.A SJ13.3 U$8.128(PD3) U$21.8(1A4)
MCU_DO4: D7.A SJ14.3 U$8.126(PD4) U$21.11(2A1)
MCU_DO5: D8.A SJ15.3 U$8.125(PD5) U$21.13(2A2)
MCU_DO6: D9.A SJ16.3 U$8.121(PD6) U$21.15(2A3)
MCU_DO7: D10.A SJ17.3 U$8.119(PD7) U$21.17(2A4)
MCU_INT: J3.6 U$8.98(PD11)
MCU_LTE_AP_READY: U$8.92(PD12) ; also sheet 1
MCU_LTE_DBG_RXD: U$8.75(PA9/PGMM1) ; also sheet 1
MCU_LTE_DBG_TXD: U$8.66(PA10/PGMM2) ; also sheet 1
MCU_LTE_PWRKEY: U$8.84(PD14) ; also sheet 1
MCU_LTE_RESET_IN: U$8.106(PD15) ; also sheet 1
MCU_LTE_STATUS: U$8.88(PD13) ; also sheet 1
MCU_LTE_UART_CTS: U$8.59(PA25/PGMD13) ; also sheet 1
MCU_LTE_UART_DCD: U$8.62(PA26/PGMD14) ; also sheet 1
MCU_LTE_UART_DTR: U$8.70(PA27/PGMD15) ; also sheet 1
MCU_LTE_UART_RI: U$8.129(PA29) ; also sheet 1
MCU_LTE_UART_RTS: U$8.56(PA24/PGMD12) ; also sheet 1
MCU_LTE_UART_RXD: U$8.32(PA21/PGMD9) ; also sheet 1
MCU_LTE_UART_TXD: U$8.37(PA22/PGMD10) ; also sheet 1
MCU_NRST: MCU_C28.1 MCU_R3.2 MCU_R8.1 MCU_S0.1 MCU_S0.2 U$8.83(NRST)
MCU_SPI_CS0: J3.5 U$8.64(PA11/PGMM3)
MCU_SPI_CS1: U$8.118(PA31) U$12.16(!CS)
MCU_SPI_CS2: U$8.116(PA30) U$16.16(!CS)
MCU_SPI_MISO: J3.9 U$8.68(PA12/PGMD0) U$12.17(SDO) U$16.17(SDO)
MCU_SPI_MOSI: J3.1 U$8.42(PA13/PGMD1) U$12.14(SDI) U$16.14(SDI)
MCU_SPI_SCK: J3.7 U$8.51(PA14/PGMD2) U$12.15(SCLK) U$16.15(SCLK)
MCU_TCK/SWCLK: J1.4(SWDCLK/TCK) MCU_R1.1 U$8.89(PB7)
MCU_TDI: J1.8(NC/TDI) MCU_R0.1 U$8.105(PB4)
MCU_TDO/TRACESWO: J1.6(SWO/TDO) U$8.109(PB5)
MCU_TMS/SWDIO: J1.2(SWDIO/TMS) MCU_R2.1 U$8.79(PB6)
MCU_TWCK0: MCU_R13.1 U$8.77(PA4/PGMNCMD) ; also sheet 1
MCU_TWD0: MCU_R14.1 U$8.91(PA3) ; also sheet 1
MCU_VBUS: MCU_R9.2 MCU_R12.2 U$8.122(PC21)
MCU_VDDOUT: MCU_C16.1 MCU_C17.1 MCU_C18.1 MCU_C19.1 MCU_C20.1 MCU_C21.1 MCU_L1.2 U$8.3(VDDOUT) U$8.29(VDDCORE) U$8.33(VDDCORE) U$8.50(VDDCORE) U$8.81(VDDCORE) U$8.107(VDDCORE) U$8.123(VDDCORE)
MCU_VDDPLL: MCU_C23.1 MCU_L1.1 MCU_R6.2 U$8.139(VDDPLL)
N$7: D13.1(A) PWR_FUSE0.1
N$14: PWR_Q0.1(B) PWR_R2.1 PWR_R3.2
N$15: IC1.5(ADJ) MCU_C27.+
N$22: PWR_D0.A PWR_R1.1
N$24: PWR_L0.2 U$13.2(VOUT)
N$25: FB2.2 PWR_C0.+ PWR_C1.+ PWR_C2.1 U$13.1(VIN)
N$26: PWR_C3.+ PWR_C4.+ PWR_L0.1 PWR_R0.1 U$13.4(FB)
N$27: PWR_D0.C PWR_Q0.3(C)
N$29: SJ20.2 U$8.31(PB3)
N$31: MCU_R5.1 U$8.141(PB8)
N$32: SJ7.2 U$12.9(FORCE2)
N$33: MCU_C31.1 MCU_R9.1 MCU_VAR1.1 U$5.1(VBUS)
N$36: RTD_R1.2 U$16.4(BIAS) U$16.5(REFIN+)
N$39: RTD_C0.+ RTD_C1.1 RTD_C2.1 RTD_C3.+ RTD_L0.1 U$12.2(DVDD) U$12.3(VDD)
N$44: MCU_C22.+ MCU_R6.1
N$45: RTD_R1.1 U$16.6(REFIN-) U$16.7(ISENSOR)
N$47: RTD_R0.2 U$12.4(BIAS) U$12.5(REFIN+)
N$48: RTD_R0.1 U$12.6(REFIN-) U$12.7(ISENSOR)
N$56: SJ13.2 U$22.4(4B)
N$57: SJ14.2 U$22.5(5B)
N$58: SJ12.2 U$22.3(3B)
N$59: SJ15.2 U$22.6(6B)
N$60: AI_FUSE0.2 AI_R0.1 AI_R4.2
N$61: RTD_C10.1 SJ8.3
N$62: RTD_C4.1 SJ6.3
N$63: RTD_C5.1 SJ6.1
N$64: RTD_C11.1 SJ8.1
N$65: RTD_C6.1 RTD_C7.+ RTD_C8.1 RTD_C9.+ RTD_L1.1 U$16.2(DVDD) U$16.3(VDD)
N$66: SJ9.2 U$16.9(FORCE2)
N$67: AI_FUSE1.2 AI_R1.1 AI_R5.2
N$68: AI_FUSE2.2 AI_R2.1 AI_R6.2
N$69: AI_FUSE3.2 AI_R3.1 AI_R7.2
N$70: SJ16.2 U$22.7(7B)
N$71: SJ17.2 U$22.8(8B)
N$72: SJ11.2 U$22.2(2B)
N$73: SJ10.2 U$22.1(1B)
N$74: DO_FUSE0.1 U$22.20(1C)
N$75: DO_FUSE1.1 U$22.19(2C)
N$76: DO_FUSE2.1 U$22.18(3C)
N$77: DO_FUSE3.1 U$22.17(4C)
N$78: DO_FUSE4.1 U$22.16(5C)
N$79: DO_FUSE5.1 U$22.15(6C)
N$80: DO_FUSE6.1 U$22.14(7C)
N$81: DO_FUSE7.1 U$22.13(8C)
N$82: D3.C DO_R0.1
N$83: DI_Q0.E DI_R0.2
N$85: DI_D2.A DI_Q0.C
N$86: D4.C DO_R1.1
N$87: DI_D0.C DI_Q0.B
N$88: DI_D0.A DI_R1.1
N$89: D5.C DO_R2.1
N$90: DI_Q1.E DI_R5.2
N$91: DI_D3.A DI_Q1.C
N$92: D6.C DO_R3.1
N$93: DI_D2.C DI_R2.2
N$94: DI_D4.C DI_Q1.B
N$95: D7.C DO_R4.1
N$96: DI_D4.A DI_R4.1
N$97: DI_D3.C DI_R6.2
N$98: D8.C DO_R5.1
N$99: DI_Q2.E DI_R9.2
N$100: DI_D6.A DI_Q2.C
N$101: D9.C DO_R6.1
N$102: DI_D7.C DI_Q2.B
N$103: DI_D7.A DI_R8.1
N$104: D10.C DO_R7.1
N$105: DI_D6.C DI_R10.2
N$106: DI_Q3.E DI_R13.2
N$107: DI_D9.A DI_Q3.C
N$108: DI_D10.C DI_Q3.B
N$109: DI_D10.A DI_R12.1
N$110: DI_D9.C DI_R14.2
N$111: DI_Q4.E DI_R17.2
N$112: DI_D12.A DI_Q4.C
N$113: DI_D13.C DI_Q4.B
N$114: DI_D13.A DI_R16.1
N$115: DI_D12.C DI_R18.2
N$116: DI_Q5.E DI_R21.2
N$117: DI_D15.A DI_Q5.C
N$118: DI_D16.C DI_Q5.B
N$119: DI_D16.A DI_R20.1
N$120: DI_D15.C DI_R22.2
N$121: DI_Q6.E DI_R25.2
N$122: DI_D18.A DI_Q6.C
N$123: DI_D19.C DI_Q6.B
N$124: DI_D19.A DI_R24.1
N$125: DI_D18.C DI_R26.2
N$126: DI_Q7.E DI_R29.2
N$127: DI_D21.A DI_Q7.C
N$128: DI_D22.C DI_Q7.B
N$129: DI_D22.A DI_R28.1
N$130: DI_D21.C DI_R30.2
N$131: CNT_Q0.E CNT_R0.2
N$132: CNT_D2.A CNT_Q0.C
N$133: CNT_D0.C CNT_Q0.B
N$134: CNT_D0.A CNT_R1.1
N$135: CNT_D2.C CNT_R2.2
N$136: CNT_Q1.E CNT_R5.2
N$137: CNT_D3.A CNT_Q1.C
N$138: CNT_D4.C CNT_Q1.B
N$139: CNT_D4.A CNT_R4.1
N$140: CNT_D3.C CNT_R6.2
N$141: CNT_D1.C CNT_R2.1 CNT_R3.2 U$23.1(I0)
N$142: CNT_D5.C CNT_R6.1 CNT_R7.2 U$23.3(I1)
N$143: J1.10(!RESET) MCU_R3.1
N$144: MCU_C36.2 MCU_R4.2 Y1.1
N$145: MCU_C37.2 MCU_R5.2 Y1.3
N$147: MCU_C29.1 U$2.2 U$8.35(PA7/PGMNVALID)
N$148: MCU_C30.1 U$2.1 U$8.36(PA8/PGMM0)
N$149: MCU_R11.1 U$5.3(D+)
N$150: MCU_R10.1 U$5.2(D-)
N$151: MCU_R4.1 U$8.142(PB9)
N$154: SJ19.2 U$8.26(PB2)
P$1: J3.3 MCU_VAR0.2 MCU_VAR1.2 SJ18.2 SJ21.2 SJ22.2 SJ23.2 U$5.6(SHIELD) U$5.7(SHIELD) U$5.8(SHIELD) U$5.9(SHIELD) U$5.10(SHIELD) U$5.11(SHIELD) ; supply symbol labelled PE ; also sheet 1
PWR_LED: PWR_R3.1 U$8.78(PD16)
RS_!RE: SJ19.3 ; also sheet 1
RS_DE: SJ20.3 ; also sheet 1
RS_DI: U$8.20(PB1) ; also sheet 1
RS_RO: U$8.21(PB0) ; also sheet 1
RTC_MFP: U$8.67(PD19) ; also sheet 1
RTD0_!DRDY: U$8.74(PD17) U$12.1(!DRDY)
RTD0_FORCE_N: U$12.12(FORCE-) U$28.4
RTD0_FORCE_P: SJ7.3 U$12.8(FORCE+) U$28.1
RTD0_RTDIN_N: RTD_C4.2 RTD_C5.2 U$12.11(RTDIN-) U$28.3
RTD0_RTDIN_P: SJ6.2 U$12.10(RTDIN+) U$28.2
RTD1_!DRDY: U$8.69(PD18) U$16.1(!DRDY)
RTD1_FORCE_N: U$16.12(FORCE-) U$28.8
RTD1_FORCE_P: SJ9.3 U$16.8(FORCE+) U$28.5
RTD1_RTDIN_N: RTD_C10.2 RTD_C11.2 U$16.11(RTDIN-) U$28.7
RTD1_RTDIN_P: SJ8.2 U$16.10(RTDIN+) U$28.6
Unconnected: J1.7(KEY) U$5.4(ID) U$8.8(GND) U$8.11(PC0) U$8.12(PC27) U$8.13(PC26) U$8.14(PC31) U$8.15(PC30) U$8.16(PC29) U$8.19(PC13) U$8.27(PE4) U$8.28(PE5) U$8.38(PC1) U$8.39(PC2) U$8.40(PC3) U$8.41(PC4) U$8.44(GND) U$8.45(PA16/PGMD4) U$8.46(PA23/PGMD11) U$8.48(PC7) U$8.49(PA15/PGMD3) U$8.54(PC6) U$8.57(PD23) U$8.58(PC5) U$8.60(PD22) U$8.61(GND) U$8.63(PD21) U$8.65(PD20) U$8.73(PA5/PGMRDY) U$8.76(PC28) U$8.82(PC8) U$8.85(TEST) U$8.86(PC9) U$8.87(PB12) U$8.90(PC10) U$8.93(PA2) U$8.94(PC11) U$8.95(GND) U$8.97(PC14) U$8.100(PC16) U$8.103(PC17) U$8.104(JTAGSEL) U$8.111(PC18) U$8.112(PA28) U$8.114(PA6/PGMNOE) U$8.115(GND) U$8.117(PC19) U$8.120(PC20) U$8.124(PC22) U$8.127(PC23) U$8.130(PC24) U$8.133(PC25) U$8.135(GND) U$8.138(GND) U$8.140(PB14) U$8.144(PB13) U$12.20(N.C.) U$16.20(N.C.) U$22.10(N.C.) U$22.11(N.C.) U$23.5(I2) U$23.6(!O2) U$23.7(GND) U$23.8(!O3) U$23.9(I3) U$23.10(!O4) U$23.11(I4) U$23.12(!O5) U$23.13(I5)

### Notes on the sheet
- Atmel/Microchip SAM4E IC | I/O Interface
- SPI Interface
- Digital Input Circuits | Counters
- Observations
- SPI interface that connects ESP32 board to SAM4E
  board for Internet connectivity (Wi-Fi and Ethernet).
  
  Interrupt lines are set up each way as well.
- JTAG Interface
- (1)
- Analog Input Circuits
- Observations
- The 0Ohm resistor may be removed in order to isolate the JTAG port
  from this system reset signal.
- USB Interface
- Digital Output Circuits
- MCV 1,5/8-G-3,81 I/Os
- Observations
- Varistors added as a fail-safe circuit in case of high currents.
  
  MCU_R9 and MCU_R12 build up a divider bridge from VBUS +5V to implement plug-in detection
  (5V level gets lowered to a PIO compatible 3.3V level) through PC21.
- Supply Protection Circuit
- VDDIO Capacitors
- VDDIN Capacitors
- VDDPLL Protection Circuit
- Observations
- DO0-DO7 pins are connected
  to one of the I/O arrays (MCV 1,5/8-G-3,81).
  
  One can choose whether the digital
  output pin is forwarded as it is or inverted via
  soldering the right path of the solder jumpers.
- Observations
- VDDCORE Capacitors
- MAX31865 RTD-To-Digital Converters
- (1)
  CAN0 and RS-422/485 will share common pins PB2 and PB3 as the following configurations
  are multiplexed to them.
  _______________________________
  I/O Line    Periph. A    Periph. C
  _______________________________
  PB2          CANTX0      CTS0
  _______________________________
  PB3          CANRX0      RTS0
  _______________________________
  Solder jumpers have been connected to the mentioned lines to choose the desired connections
  to those pins.
- MCV 1,5/8-G-3,81 I/O
- Power Supply
- Tantalum
- Observations
- SAM4E, POWER, RTD, I/O
- FORCE+, FORCE-, RTDIN+ and RTDIN- pins are connected
  to one of the I/O arrays alongside two analog inputs
  (MCV 1,5/8-G-3,81).
  
  FORCE2 pin can be tied to GND or FORCE+ pin depending
  if the connection is 2-wire or 3-wire type.
  
  Capacitor value between RTDIN+ and RTDIN- is to be
  selected in relationship with the connected RTD
  (10nF for 1KOhm and 100nF for 100Ohm)
- A

## Library data of the parts
AI_C0 AI_C1-AI_C3 CAN_C1 CAN_C3 CNT_C0 EEP_C0 LTE_C0 LTE_C4 MCU_C0 MCU_C2 MCU_C4 MCU_C6 MCU_C8 MCU_C10 MCU_C12 MCU_C14 MCU_C22 MCU_C26 MCU_C27 PWR_C0 PWR_C1 PWR_C3-PWR_C7 RS_C0 RTC_C0 RTD_C0 RTD_C3 RTD_C7 RTD_C9 SN_C0 = rcl:CPOL-EU: POLARIZED CAPACITOR, European symbol; SPICEPREFIX: C
AI_FUSE0 AI_FUSE1-AI_FUSE3 DO_FUSE0 DO_FUSE1-DO_FUSE7 PWR_FUSE0 = fuse:MF-SMDF: MF-SMDF Series - PRC Resettable Fuses Source: http://www.farnell.com/datasheets/716597.pdf
AI_R0 AI_R1-AI_R7 CAN_R0 CAN_R1-CAN_R13 CNT_R0 CNT_R1-CNT_R7 DI_R0 DI_R1-DI_R31 DO_R0 DO_R1-DO_R7 LTE_R1-LTE_R24 MCU_R0 MCU_R1-MCU_R14 PWR_R0 PWR_R1-PWR_R3 RS_R0 RS_R1-RS_R7 RTC_R0 RTC_R1 RTD_R0 RTD_R1 = rcl:R-EU_: RESISTOR, European symbol; SPICEPREFIX: R
CAN_C0 CAN_C2 CNT_C1 EEP_C1 LTE_C1-LTE_C3 LTE_C5-LTE_C20 MCU_C1 MCU_C3 MCU_C5 MCU_C7 MCU_C9 MCU_C11 MCU_C13 MCU_C15-MCU_C21 MCU_C23-MCU_C25 MCU_C28-MCU_C31 MCU_C36 MCU_C37 PWR_C2 PWR_C8 RS_C1 RTC_C1 RTC_C3-RTC_C5 RTD_C1 RTD_C2 RTD_C4-RTD_C6 RTD_C8 RTD_C10 RTD_C11 SN_C1 = rcl:C-EU: CAPACITOR, European symbol; SPICEPREFIX: C
CAN_L0 CAN_L1 LTE_L0 MCU_L0 MCU_L1 PWR_L0 RS_L0 RTD_L0 RTD_L1 = rcl:L-EU: INDUCTOR, European symbol; SPICEPREFIX: L
CNT_D0 CNT_D1 CNT_D4 CNT_D5 DI_D0 DI_D1 DI_D4 DI_D5 DI_D7 DI_D8 DI_D10 DI_D11 DI_D13 DI_D14 DI_D16 DI_D17 DI_D19 DI_D20 DI_D22 DI_D23 = SparkFun-DiscreteSemi:DIODE-ZENER: Zener Diode A Zener diode allows current to flow from its anode to its cathode like a normal semiconductor diode, but it also permits current to flow in the reverse direction when its "Zener voltage" is reached. - WIkipedia; PROD_ID: DIO-12442; VALUE: 5.6V
CNT_D2 CNT_D3 D3-D10 DI_D2 DI_D3 DI_D6 DI_D9 DI_D12 DI_D15 DI_D18 DI_D21 PWR_D0 = SparkFun-LED:LED-RED: Red SMD LED Used in manufacturing of most products at SparkFun Packages: 0603 - KB - KingBright (DIO-17976) SMD 0603 package [Datasheet] <https://www.kingbrightusa.com/images/catalog/SPEC/APT1608SURCK.pdf> 0603 - (DIO-00819, has gone EOL) SMD 0603 package 0603 SMART - SMD 0603 SMART package ( more efficient and expensive)[Product Link] <http://www.osram-os.com/Graphics/XPic2/00077099_0.pdf> 1206 - SMD1206 package [Product Link] <https://www.sparkfun.com/datasheets/DevTools/LilyPad/Q150OVS4.pdff> SparkFun Products: Pro Mini 328 -5V <https://www.sparkfun.com/products/821> RedBoard <https://www.sparkfun.com/products/12757> IOIO-OTG <https://www.sparkfun.com/products/13613>; PROD_ID: DIO-09912
CNT_Q0 CNT_Q1 DI_Q0 DI_Q1-DI_Q7 = transistor-pnp:BC807*: PNP Transistror
D1 D12 = SparkFun-DiscreteSemi:DIODE_TVS; PROD_ID: DIO-14502
D2 = SparkFun-DiscreteSemi:DIODE-SCHOTTKY: Schottky diode A Schottky diode is a semiconductor diode which has a low forward voltage drop and a very fast switching action.; PROD_ID: DIO-08411; VALUE: 700mA/40V/533mV
D13 = SparkFun-DiscreteSemi:DIODE-SCHOTTKY: Schottky diode A Schottky diode is a semiconductor diode which has a low forward voltage drop and a very fast switching action.; PROD_ID: DIO-08411
DIODE_ARRAY = my-Vishay:VESD16A2-03G-G3-08
FB2 = SparkFun-Coils:FERRITE_BEAD: Ferrite Bead (blocks, cores, rings, chokes, etc.) Inductor with layers of ferrite used to suppress high frequencies. Often used to isolate high frequency noise. SparkFun Products: IOIO-OTG - V2.2 <https://www.sparkfun.com/products/13613> SparkFun SAMD21 Mini Breakout <https://www.sparkfun.com/products/13664> SparkFun 6 Degrees of Freedom Breakout - LSM6DS3 <https://www.sparkfun.com/products/13339> SparkFun SAMD21 Dev Breakout <https://www.sparkfun.com/products/13672> Lilypad MP3 <https://www.sparkfun.com/products/11013>; PROD_ID: NDUC-14988
G1 = battery:CR2032H: LI BATTERY Varta
IC1 = linear:LM336: 2.5-V INTEGRATED REFERENCE CIRCUITS LM236 Source: http://focus.ti.com/lit/ds/symlink/lm336-2.5.pdf
J1 = SparkFun-Connectors:CORTEX_JTAG_DEBUG: Cortex Debug Connector - 10 pin Supports JTAG debug, Serial Wire debug, and Serial Wire Viewer. PTH and SMD connector options available. General Connector Information <http://infocenter.arm.com/help/topic/com.arm.doc.faqs/attached/13634/cortex_debug_connectors.pdf> Products: PTH Connector <http://www.digikey.com/product-detail/en/cnc-tech/3220-10-0100-00/1175-1627-ND/3883661> -via Digi-Key SparkFun PSoc <https://www.sparkfun.com/products/13229> SparkFun T <https://www.sparkfun.com/products/13810>; PROD_ID: CONN-15353
J3 = SparkFun-Connectors:CONN_05X2: Multi connection point. Often used as Generic Header-pin footprint for 0.1 inch spaced/style header connections For AVR SPI programming port, see special device with nice symbol: "AVR_SPI_PROG_5x2.dev" You can populate with any combo of single row headers, but if you'd like an exact match, check these: 2x5 AVR ICSP Male Header <https://www.sparkfun.com/products/778> (PRT-00778) 2x5 Pin Shrouded Header <https://www.sparkfun.com/products/8506> (PRT-08506) On any of the 0.1 inch spaced packages, you can populate with these: Break Away Headers - Straight <https://www.sparkfun.com/products/116> (PRT-00116) Break Away Male Headers - Right Angle <https://www.sparkfun.com/products/553> (PRT-00553) Female Headers <https://www.sparkfun.com/products/115> (PRT-00115) Break Away Headers - Machine Pin <https://www.sparkfun.com/products/117> (PRT-00117) Break Away Female Headers - Swiss Machine Pin <https://www.sparkfun.com/products/743> (PRT-00743) Special note: the shrouded connector mates well with our 5x2 ribbon cables: 2x5 Pin IDC Ribbon Cable <https://www.sparkfun.com/products/8535> (PRT-08535); PROD_ID: CONN-09508
LTE_IC = my-Quectel:EC20CEFASG-MINIPCIE
MCU_S0 = SparkFun-Switches:MOMENTARY-SWITCH-SPST-2: Momentary Switch (Pushbutton) - SPST - Two Circuits Normally-open (NO) SPST momentary switches (buttons, pushbuttons). Schematic symbol includes two switch circuits. Variants SMD-4.6MMX2.8MM - 4.60mm x 2.80mm Tactile Momentary Button Switch - Used on SparkFun Pro Micro - RP2040 <https://www.sparkfun.com/products/17717> SMD-5.2MM - Mini Pushbutton Switch - SMD <https://www.sparkfun.com/products/8720> - Used on Arduino Pro Mini <https://www.sparkfun.com/products/11114>; PROD_ID: SWCH-15606
MCU_VAR0 MCU_VAR1 = varistor:VARISTOR: VARISTOR
PWR_Q0 Q1 Q2 = SparkFun-DiscreteSemi:TRANS_NPN: NPN transistor Current controlled devices typically used to amplify current or used as a switch. BC547 - COM-08928 <http://www.sparkfun.com/products/8928> (TO-92 45V 100mA) (1.Collector 2.Base 3.Emitter) 2N3904 - COM-00521 <http://www.sparkfun.com/products/521> (TO-92 40V 200mA) (1.Emitter 2.Base 3.Collector) P2N2222A - COM-12852 <http://www.sparkfun.com/products/12852> (TO-92 40V 600mA) (1.Collector 2.Base 3.Emitter); PROD_ID: TRANS-08049
SJ1-SJ5 SJ18 SJ21-SJ23 = jumper:SJ: SMD solder JUMPER
SJ6-SJ17 SJ19 SJ20 = jumper:SJ2W: SMD solder JUMPER
TRANSLATOR0 = my-TexasInstruments:TXS0108EPWR
TRANSLATOR1 = my-TexasInstruments:TXS0104EPWR
U$1 = my-MicrochipTechnology:24LC1025T-I/SN
U$2 = my-EpsonTiming:FC-135-32.7680KA-AG0: Crystals 32.768KHz 20ppm 7.0pF -40C +85C
U$3 = my-STMicroelectronics:ESDALC6V1-5P6
U$4 = my-Molex:104224-0820: Memory Card Connectors nanoSIM 1.11mm Card Conn 6Ckt Push/Pull
U$5 = my-Molex:47346-1001
U$6 = my-MaximIntegrated:MAX3485CSA+T: RS-422/RS-485 Interface IC 3.3V Powered, 10Mbps and Slew-Rate Limited, True RS-485/RS-422 Transceivers
U$7 U$14 U$26 U$28 = my-PheonixConn:1803510: MCV 1,5/11-G-3,81 Nominal current is 8A. Rated voltage (III/3) is 160V, (III/2) is 160V, (II/2) is 250V.
U$8 = my-MicrochipTechnology:ATSAM4E8EB-ANR
U$9 = my-MicrochipTechnology:MCP7940N-I/SN: Real Time Clock I2C GP RTCC 64B SRAM
U$10 = my-ECSInc:ECS-.327-7-34B-C-TR
U$11 U$17 = my-TexasInstruments:SN65HVD234DR: CAN Interface IC SLEEP MODE
U$12 U$16 = my-MaximIntegrated:MAX31865AAP+T: Data Acquisition ADCs/DACs - Specialised RTD to Digital Converter
U$13 = my-TexasInstruments:LM2576SX-3.3/NOPB: Switching Voltage Regulators 3A SD VTG Reg
U$21 = my-TexasInstruments:SN74HC240DBR: Buffers & Line Drivers Octal Buffers and Line Drivers
U$22 = my-TexasInstruments:ULN2803CDWR: Darlington Transistors 50-V, eight-channel darlington array
U$23 = my-Onsemi:74AC14SCX: Hex Inverter with Schmitt Trigger Input
Y1 = SparkFun-Clocks:CRYSTAL: Crystals (Generic) These are passive quartz crystals, which can be used as a clock source for a microcontroller. Crystal's are two-terminal devices. They require external "load" capacitors to generate an oscillating signal.